# Altium project IOT Arduino Board 4 Layers.PrjPcb (part 1 of 2)
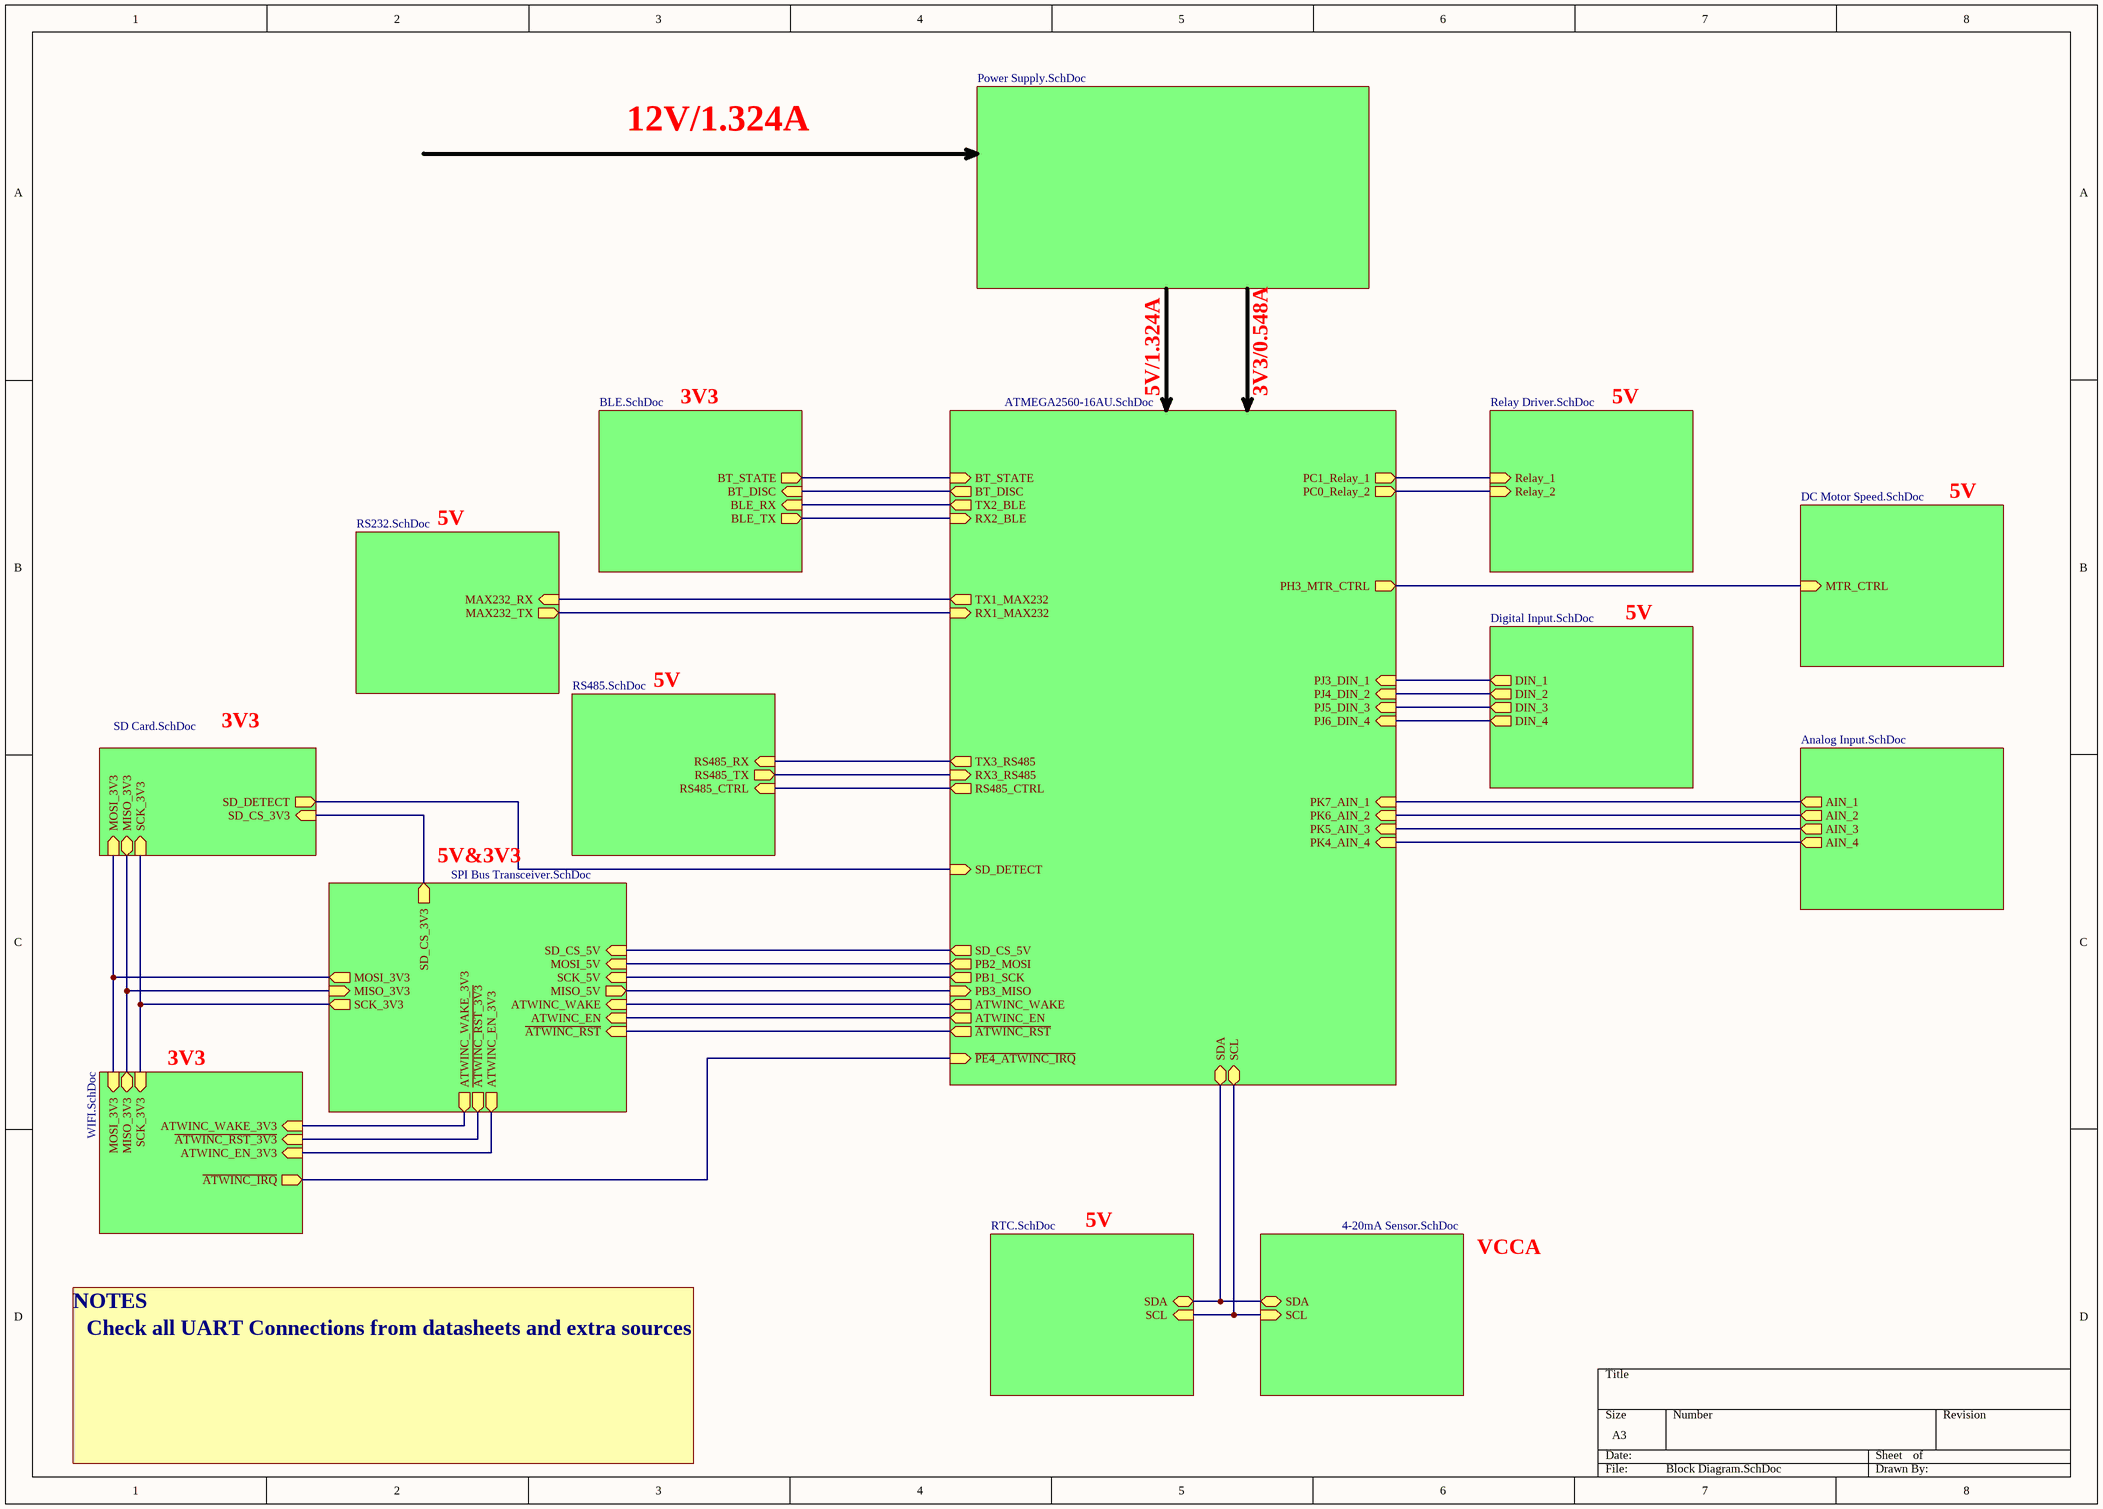
[diagram p0: Block Diagram.SchDoc]
15 sheets, 159 parts. Net scope: hierarchical (ports join the sheet entries above them; power ports are global).
Board file: PCB1.PcbDoc
Sheets:
  Block Diagram.SchDoc
    ATMEGA2560-16AU = ATMEGA2560-16AU.SchDoc
    Power Supply = Power Supply.SchDoc
    Relay Driver = Relay Driver.SchDoc
    DC Motor Speed = DC Motor Speed.SchDoc
    Digital Input = Digital Input.SchDoc
    Analog Input = Analog Input.SchDoc
    4-20mA Sensor = 4-20mA Sensor.SchDoc
    RTC = RTC.SchDoc
    BLE = BLE.SchDoc
    WIFI = WIFI.SchDoc
    SD Card = SD Card.SchDoc
    RS232 = RS232.SchDoc
    RS485 = RS485.SchDoc
    SPI Bus Transceiver = SPI Bus Transceiver.SchDoc

## Sheet Block Diagram.SchDoc
size A3; SheetNumber: 1; SheetTotal: 15

### Sub-sheets
4-20mA Sensor = 4-20mA Sensor.SchDoc: SCL (in), SDA (bidir)
Analog Input = Analog Input.SchDoc: AIN_1 (out), AIN_2 (out), AIN_3 (out), AIN_4 (out)
ATMEGA2560-16AU = ATMEGA2560-16AU.SchDoc: PC1_Relay_1 (out), PC0_Relay_2 (out), PH3_MTR_CTRL (out), PJ3_DIN_1 (in), PJ4_DIN_2 (in), PJ5_DIN_3 (in), PJ6_DIN_4 (in), PK7_AIN_1 (in), PK6_AIN_2 (in), PK5_AIN_3 (in), PK4_AIN_4 (in), SCL (bidir), SDA (bidir), RX2_BLE (in), TX2_BLE (out), BT_STATE (in), BT_DISC (out), SD_CS_5V (out), PB2_MOSI (out), PB1_SCK (out), SD_DETECT (in), PB3_MISO (in), RS485_CTRL (out), ATWINC_WAKE (out), ATWINC_EN (out), TX1_MAX232 (out), RX1_MAX232 (in), RX3_RS485 (in), TX3_RS485 (out), ~{ATWINC_RST} (out), ~{PE4_ATWINC_IRQ} (in)
BLE = BLE.SchDoc: BT_STATE (out), BT_DISC (in), BLE_RX (in), BLE_TX (out)
DC Motor Speed = DC Motor Speed.SchDoc: MTR_CTRL (in)
Digital Input = Digital Input.SchDoc: DIN_1 (out), DIN_2 (out), DIN_3 (out), DIN_4 (out)
Power Supply = Power Supply.SchDoc: no entries
Relay Driver = Relay Driver.SchDoc: Relay_1 (in), Relay_2 (in)
RS232 = RS232.SchDoc: MAX232_RX (in), MAX232_TX (out)
RS485 = RS485.SchDoc: RS485_RX (in), RS485_TX (out), RS485_CTRL (in)
RTC = RTC.SchDoc: SCL (in), SDA (bidir)
SD Card = SD Card.SchDoc: SD_DETECT (out), MISO_3V3 (bidir), SCK_3V3 (in), MOSI_3V3 (in), SD_CS_3V3 (in)
SPI Bus Transceiver = SPI Bus Transceiver.SchDoc: SD_CS_5V (in), MOSI_5V (in), SCK_5V (in), SCK_3V3 (out), MOSI_3V3 (out), ATWINC_EN_3V3 (out), ~{ATWINC_RST_3V3} (out), ATWINC_WAKE (in), ATWINC_EN (in), MISO_5V (out), MISO_3V3 (in), SD_CS_3V3 (out), ATWINC_WAKE_3V3 (out), ~{ATWINC_RST} (in)
WIFI = WIFI.SchDoc: MOSI_3V3 (in), MISO_3V3 (bidir), SCK_3V3 (in), ~{ATWINC_IRQ} (out), ~{ATWINC_RST_3V3} (in), ATWINC_EN_3V3 (in), ATWINC_WAKE_3V3 (in)

### Nets
~{ATWINC_RST}: sheet ATMEGA2560-16AU/~{ATWINC_RST}, sheet SPI Bus Transceiver/~{ATWINC_RST}
ATWINC_EN: sheet ATMEGA2560-16AU/ATWINC_EN, sheet SPI Bus Transceiver/ATWINC_EN
MISO: sheet ATMEGA2560-16AU/PB3_MISO, sheet SPI Bus Transceiver/MISO_5V
MOSI: sheet ATMEGA2560-16AU/PB2_MOSI, sheet SPI Bus Transceiver/MOSI_5V
SCK: sheet ATMEGA2560-16AU/PB1_SCK, sheet SPI Bus Transceiver/SCK_5V
SD_CS_5V: sheet ATMEGA2560-16AU/SD_CS_5V, sheet SPI Bus Transceiver/SD_CS_5V
NetD12_K: sheet ATMEGA2560-16AU/PK4_AIN_4, sheet Analog Input/AIN_4
NetD13_K: sheet ATMEGA2560-16AU/PK5_AIN_3, sheet Analog Input/AIN_3
NetD14_K: sheet ATMEGA2560-16AU/PK6_AIN_2, sheet Analog Input/AIN_2
NetD15_K: sheet ATMEGA2560-16AU/PK7_AIN_1, sheet Analog Input/AIN_1
NetJ14_1: sheet ATMEGA2560-16AU/BT_STATE, sheet BLE/BT_STATE
NetJ14_4: sheet ATMEGA2560-16AU/RX2_BLE, sheet BLE/BLE_TX
NetJ14_6: sheet ATMEGA2560-16AU/BT_DISC, sheet BLE/BT_DISC
NetJ15_2: sheet SD Card/SD_CS_3V3, sheet SPI Bus Transceiver/SD_CS_3V3
NetJ15_3: sheet WIFI/MOSI_3V3, sheet SD Card/MOSI_3V3, sheet SPI Bus Transceiver/MOSI_3V3
NetJ15_5: sheet WIFI/SCK_3V3, sheet SD Card/SCK_3V3, sheet SPI Bus Transceiver/SCK_3V3
NetJ15_7: sheet WIFI/MISO_3V3, sheet SD Card/MISO_3V3, sheet SPI Bus Transceiver/MISO_3V3
NetJ15_CD: sheet ATMEGA2560-16AU/SD_DETECT, sheet SD Card/SD_DETECT
NetR7_1: sheet ATMEGA2560-16AU/SCL, sheet 4-20mA Sensor/SCL, sheet RTC/SCL
NetR8_1: sheet ATMEGA2560-16AU/SDA, sheet 4-20mA Sensor/SDA, sheet RTC/SDA
NetR9_2: sheet ATMEGA2560-16AU/PC1_Relay_1, sheet Relay Driver/Relay_1
NetR11_2: sheet ATMEGA2560-16AU/PC0_Relay_2, sheet Relay Driver/Relay_2
NetR13_2: sheet ATMEGA2560-16AU/PH3_MTR_CTRL, sheet DC Motor Speed/MTR_CTRL
NetR16_5: sheet ATMEGA2560-16AU/PJ6_DIN_4, sheet Digital Input/DIN_4
NetR16_6: sheet ATMEGA2560-16AU/PJ5_DIN_3, sheet Digital Input/DIN_3
NetR16_7: sheet ATMEGA2560-16AU/PJ4_DIN_2, sheet Digital Input/DIN_2
NetR16_8: sheet ATMEGA2560-16AU/PJ3_DIN_1, sheet Digital Input/DIN_1
NetR42_1: sheet WIFI/ATWINC_EN_3V3, sheet SPI Bus Transceiver/ATWINC_EN_3V3
NetR43_2: sheet ATMEGA2560-16AU/~{PE4_ATWINC_IRQ}, sheet WIFI/~{ATWINC_IRQ}
NetU3_9: sheet ATMEGA2560-16AU/ATWINC_WAKE, sheet SPI Bus Transceiver/ATWINC_WAKE
NetU3_13: sheet ATMEGA2560-16AU/TX2_BLE, sheet BLE/BLE_RX
NetU3_45: sheet ATMEGA2560-16AU/RX1_MAX232, sheet RS232/MAX232_TX
NetU3_46: sheet ATMEGA2560-16AU/TX1_MAX232, sheet RS232/MAX232_RX
NetU3_63: sheet ATMEGA2560-16AU/RX3_RS485, sheet RS485/RS485_TX
NetU3_64: sheet ATMEGA2560-16AU/TX3_RS485, sheet RS485/RS485_RX
NetU3_65: sheet ATMEGA2560-16AU/RS485_CTRL, sheet RS485/RS485_CTRL
NetU11_4: sheet WIFI/~{ATWINC_RST_3V3}, sheet SPI Bus Transceiver/~{ATWINC_RST_3V3}
NetU11_11: sheet WIFI/ATWINC_WAKE_3V3, sheet SPI Bus Transceiver/ATWINC_WAKE_3V3

### Notes on the sheet
- 12V/1.324A
- 3V3
- 5V/1.324A
- 3V3/0.548A
- 5V
- 5V&3V3
- VCCA
- NOTES
- Check all UART Connections from datasheets and extra sources

## Sheet ATMEGA2560-16AU.SchDoc
size A; SheetNumber: 3; SheetTotal: 15
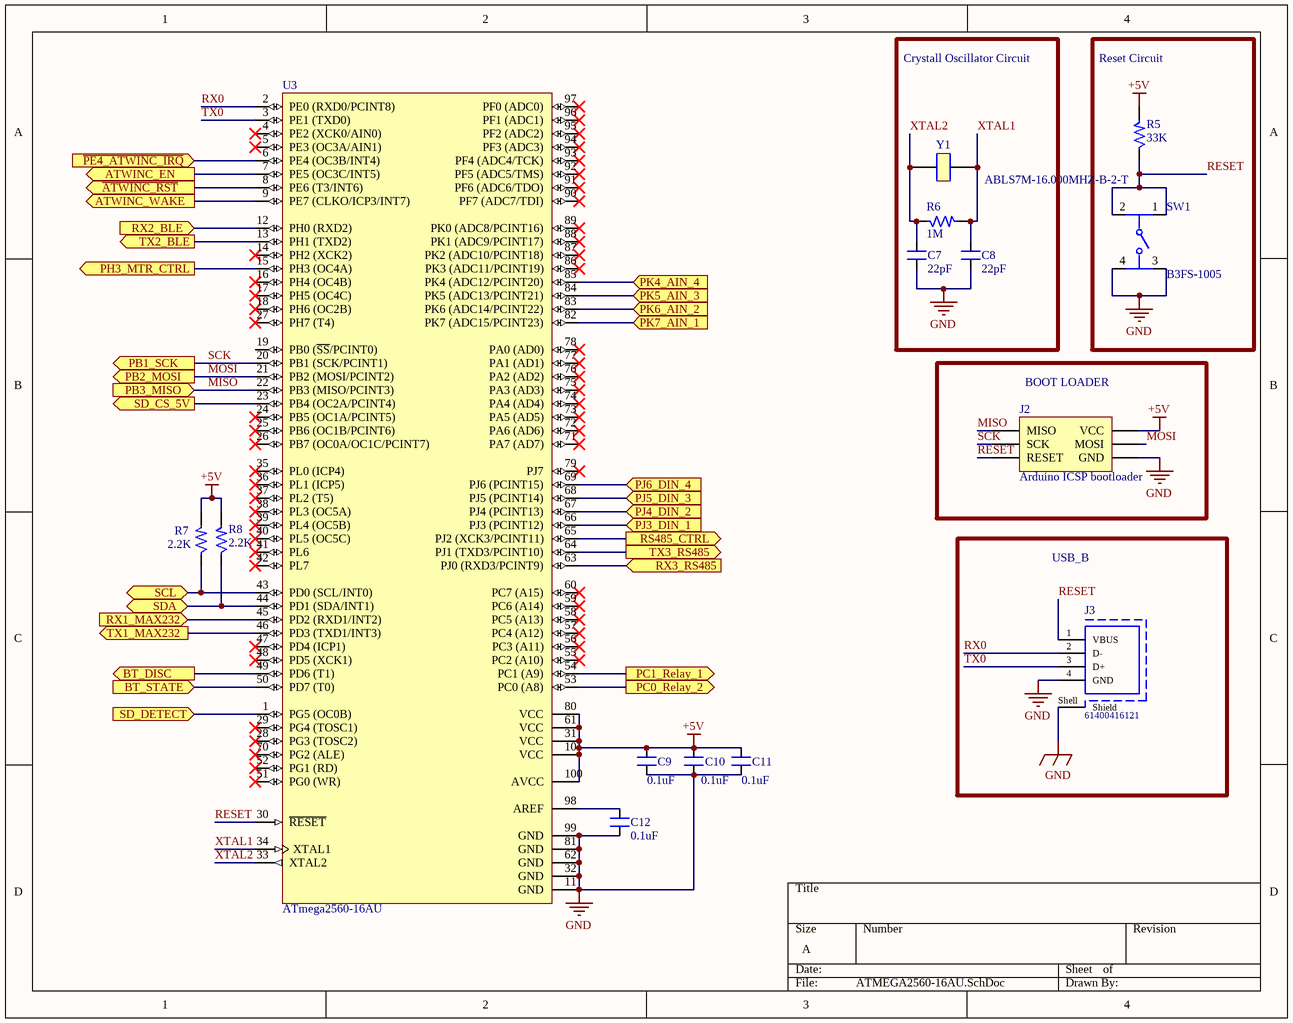
[diagram p1: ATMEGA2560-16AU.SchDoc]

### Parts
C7  22pF  [CAP_0805]
C8  22pF  [CAP_0805]
C9  0.1uF  [CAP_0805]
C10  0.1uF  [CAP_0805]
C11  0.1uF  [CAP_0805]
C12  0.1uF  [CAP_0805]
J2  Arduino ICSP bootloader  [HDR2X3]
J3  61400416121  [61400416121]
R5  33K  [RES_0805]
R6  1M  [RES_0805]
R7  2.2K  [RES_0805]
R8  2.2K  [RES_0805]
SW1  B3FS-1005  [FP-B3FS-1005-MFG]
U3  ATmega2560-16AU  [100A_L]
Y1  ABLS7M-16.000MHZ-B-2-T  [XTAL_314_240X47_SMD]

### Blocks framed on the sheet
Crystall Oscillator Circuit: C7 C8 R6 Y1
Reset Circuit: R5 SW1
BOOT LOADER: J2
USB_B: J3

### Ports
ATWINC_EN (out, see Block Diagram[4C], SPI Bus Transceiver[1C]), ATWINC_WAKE (out, see Block Diagram[4C], SPI Bus Transceiver[1C]), BT_DISC (out, see Block Diagram[4B], BLE[3B]), BT_STATE (in, see Block Diagram[4B], BLE[3B]), PB1_SCK (out, see Block Diagram[4C]), PB2_MOSI (out, see Block Diagram[4C]), PB3_MISO (in, see Block Diagram[4C]), PC0_Relay_2 (out, see Block Diagram[6B]), PC1_Relay_1 (out, see Block Diagram[6B]), PH3_MTR_CTRL (out, see Block Diagram[6B]), PJ3_DIN_1 (in, see Block Diagram[6B]), PJ4_DIN_2 (in, see Block Diagram[6B]), PJ5_DIN_3 (in, see Block Diagram[6B]), PJ6_DIN_4 (in, see Block Diagram[6B]), PK4_AIN_4 (in, see Block Diagram[6C]), PK5_AIN_3 (in, see Block Diagram[6C]), PK6_AIN_2 (in, see Block Diagram[6C]), PK7_AIN_1 (in, see Block Diagram[6C]), RS485_CTRL (out, see Block Diagram[4C], RS485[1B]), RX1_MAX232 (in, see Block Diagram[4B]), RX2_BLE (in, see Block Diagram[4B]), RX3_RS485 (in, see Block Diagram[4C]), SCL (bidir, see Block Diagram[5C], 4-20mA Sensor[4B], RTC[1B]), SD_CS_5V (out, see Block Diagram[4C], SPI Bus Transceiver[2C]), SD_DETECT (in, see Block Diagram[4C], SD Card[3B]), SDA (bidir, see Block Diagram[5C], 4-20mA Sensor[4B], RTC[1B]), TX1_MAX232 (out, see Block Diagram[4B]), TX2_BLE (out, see Block Diagram[4B]), TX3_RS485 (out, see Block Diagram[4C]), ~{ATWINC_RST} (out, see Block Diagram[4C], SPI Bus Transceiver[1C]), ~{PE4_ATWINC_IRQ} (in, see Block Diagram[4C])

### Nets
+5V: C9.2 C10.2 C11.2 J2.2(VCC) R5.2 R7.2 R8.2 U3.10(VCC) U3.31(VCC) U3.61(VCC) U3.80(VCC) U3.100(AVCC)
GND: C7.1 C8.1 C9.1 C10.1 C11.1 C12.1 J2.6(GND) J3.4(GND) J3.Shell(Shield) SW1.3 SW1.4 U3.11(GND) U3.32(GND) U3.62(GND) U3.81(GND) U3.99(GND)
~{ATWINC_RST}: U3.8(PE6_(T3/INT6)) ; port ~{ATWINC_RST}
ATWINC_EN: U3.7(PE5_(OC3C/INT5)) ; port ATWINC_EN
MISO: J2.1(MISO) U3.22(PB3_(MISO/PCINT3)) ; port PB3_MISO
MOSI: J2.4(MOSI) U3.21(PB2_(MOSI/PCINT2)) ; port PB2_MOSI
RESET: J2.5(RESET) J3.1(VBUS) R5.1 SW1.1 SW1.2 U3.30(~{RESET})
RX0: J3.2(D-) U3.2(PE0_(RXD0/PCINT8))
SCK: J2.3(SCK) U3.20(PB1_(SCK/PCINT1)) ; port PB1_SCK
SD_CS_5V: U3.23(PB4_(OC2A/PCINT4)) ; port SD_CS_5V
TX0: J3.3(D+) U3.3(PE1_(TXD0))
XTAL1: C8.2 R6.2 U3.34(XTAL1) Y1.2
XTAL2: C7.2 R6.1 U3.33(XTAL2) Y1.1
NetC12_2: C12.2 U3.98(AREF)
NetD12_K: U3.85(PK4_(ADC12/PCINT20)) ; port PK4_AIN_4
NetD13_K: U3.84(PK5_(ADC13/PCINT21)) ; port PK5_AIN_3
NetD14_K: U3.83(PK6_(ADC14/PCINT22)) ; port PK6_AIN_2
NetD15_K: U3.82(PK7_(ADC15/PCINT23)) ; port PK7_AIN_1
NetJ14_1: U3.50(PD7_(T0)) ; port BT_STATE
NetJ14_4: U3.12(PH0_(RXD2)) ; port RX2_BLE
NetJ14_6: U3.49(PD6_(T1)) ; port BT_DISC
NetJ15_CD: U3.1(PG5_(OC0B)) ; port SD_DETECT
NetR7_1: R7.1 U3.43(PD0_(SCL/INT0)) ; port SCL
NetR8_1: R8.1 U3.44(PD1_(SDA/INT1)) ; port SDA
NetR9_2: U3.54(PC1_(A9)) ; port PC1_Relay_1
NetR11_2: U3.53(PC0_(A8)) ; port PC0_Relay_2
NetR13_2: U3.15(PH3_(OC4A)) ; port PH3_MTR_CTRL
NetR16_5: U3.69(PJ6_(PCINT15)) ; port PJ6_DIN_4
NetR16_6: U3.68(PJ5_(PCINT14)) ; port PJ5_DIN_3
NetR16_7: U3.67(PJ4_(PCINT13)) ; port PJ4_DIN_2
NetR16_8: U3.66(PJ3_(PCINT12)) ; port PJ3_DIN_1
NetR43_2: U3.6(PE4_(OC3B/INT4)) ; port ~{PE4_ATWINC_IRQ}
NetU3_9: U3.9(PE7_(CLKO/ICP3/INT7)) ; port ATWINC_WAKE
NetU3_13: U3.13(PH1_(TXD2)) ; port TX2_BLE
NetU3_45: U3.45(PD2_(RXD1/INT2)) ; port RX1_MAX232
NetU3_46: U3.46(PD3_(TXD1/INT3)) ; port TX1_MAX232
NetU3_63: U3.63(PJ0_(RXD3/PCINT9)) ; port RX3_RS485
NetU3_64: U3.64(PJ1_(TXD3/PCINT10)) ; port TX3_RS485
NetU3_65: U3.65(PJ2_(XCK3/PCINT11)) ; port RS485_CTRL

Not connected (* = marked no-connect by the designer): U3 4(PE2_(XCK0/AIN0))* 5(PE3_(OC3A/AIN1))* 14(PH2_(XCK2))* 16(PH4_(OC4B))* 17(PH5_(OC4C))* 18(PH6_(OC2B))* 19(PB0_(~{SS}/PCINT0)) 24(PB5_(OC1A/PCINT5))* 25(PB6_(OC1B/PCINT6))* 26(PB7_(OC0A/OC1C/PCINT7))* 27(PH7_(T4))* 28(PG3_(TOSC2))* 29(PG4_(TOSC1))* 35(PL0_(ICP4))* 36(PL1_(ICP5))* 37(PL2_(T5))* 38(PL3_(OC5A))* 39(PL4_(OC5B))* 40(PL5_(OC5C))* 41(PL6)* 42(PL7)* 47(PD4_(ICP1))* 48(PD5_(XCK1))* 51(PG0_(WR))* 52(PG1_(RD))* 55(PC2_(A10))* 56(PC3_(A11))* 57(PC4_(A12))* 58(PC5_(A13))* 59(PC6_(A14))* 60(PC7_(A15))* 70(PG2_(ALE))* 71(PA7_(AD7))* 72(PA6_(AD6))* 73(PA5_(AD5))* 74(PA4_(AD4))* 75(PA3_(AD3))* 76(PA2_(AD2))* 77(PA1_(AD1))* 78(PA0_(AD0))* 79(PJ7)* 86(PK3_(ADC11/PCINT19))* 87(PK2_(ADC10/PCINT18))* 88(PK1_(ADC9/PCINT17))* 89(PK0_(ADC8/PCINT16))* 90(PF7_(ADC7/TDI))* 91(PF6_(ADC6/TDO))* 92(PF5_(ADC5/TMS))* 93(PF4_(ADC4/TCK))* 94(PF3_(ADC3))* 95(PF2_(ADC2))* 96(PF1_(ADC1))* 97(PF0_(ADC0))*

### Library data of the parts
C7 C8 = CAP_22PF-50V-5%-0805: 22pF ±5% 50V Ceramic Capacitor C0G, NP0 0805 (2012 Metric); Manufacturer: Yageo; Manufacturer Part Number: CC0805JRNPO9BN220; Alternate Part Number-1: 0805CG220J500NT; Case/Package: 0805; Supplier-1: SIRICOM; Supplier Part Number-1: 0805N220J500CT
C9-C12 = CAP_0.1uF-50V-5%-0805: 0.1µF ±5% 50V Ceramic Capacitor X7R 0805 (2012 Metric); Manufacturer: AVX Corporation; Manufacturer Part Number: 08055C104JAT4A; Alternate Part Number-1: 0805B104M500; Case/Package: 0805; Supplier-1: SIRICOM; Supplier Part Number-1: 0805B104J500CT
J2 = ICSP: Header, 3-Pin, Dual row; LatestRevisionDate: 17-Jul-2002; LatestRevisionNote: Re-released for DXP Platform.; Publisher: Altium Limited
J3 = CON_USB-2.0-B-TH: USB 2.0 Type B Receptacle WR-COM, Horizontal, THT, with Pads and Pegs; Manufacturer: Wurth Elektronik; Contact Resistance: 20mOhm; Rated Current: 1.5A; Working Voltage: 30VAC; Package Reference: 61400416121; Part Number: 61400416121; Packaging: Tray; Mounting Technology: THT; Gender: Receptacle; Datasheet URL: https://katalog.we-online.de/em/datasheet/61400416121.pdf; Publisher: WurthElektronik; Orientation: Horizontal; Connector Type: USB2.0TypeB; Operating Temperature: -40to105degC; Manufacturer URL: http://www.we-online.de
R5 = RES_33K-0.125W-1%-0805: Thick Film Resistors - SMD 33KOhms 1/8W 150V33 kOhms ±1% 0.125W, 1/8W Chip Resistor 0805 (2012 Metric) Thick Film; Manufacturer: Vishay BCcomponents; Manufacturer Part Number: CRG0805F33K; Alternate Part Number-1: NA; Case/Package: 0805; Supplier-1: SIRICOM; Supplier Part Number-1: WR08X3302FTL
R6 = RES_1M-0.125W-1%-0805: 1 MOhms ±1% 0.125W, 1/8W Chip Resistor 0805 (2012 Metric) Automotive AEC-Q200 Thick Film; Manufacturer: Walsin; Manufacturer Part Number: WR08X1004FTL; Alternate Part Number-1: 0805W8F1004T5E; Case/Package: 0805; Supplier-1: SIRICOM; Supplier Part Number-1: WR08X1004FTL
R7 R8 = RES_2.2K-0.125W-1%-0805: 2.2 kOhms ±1% 0.125W, 1/8W Chip Resistor 0805 (2012 Metric) Thick Film; Manufacturer: Stackpole Electronics; Manufacturer Part Number: CRG0805F2K2; Alternate Part Number-1: CR0805F82201G; Case/Package: 0805; Supplier-1: SIRICOM; Supplier Part Number-1: WR08X2201FTL
SW1 = SWITCH TACTILE SPST: SWITCH TACTILE SPST-NO 0.05A 24V; Operating Force: 2.55N; Ratings: IP00; Illumination Type: Non-Illuminated; Switch Travel: 0.25mm; Electrical Life: 100000Cycles; Current Rating: 50mA; Mechanical Life: 300000Cycles; Switch Function: Off-Mom; Actuator Type: Standard; Throw Configuration: SPST; Number of Poles: 1; Actuator Length: 0.5mm; RoHS Compliant: Yes; Packaging: Bulk; Termination: Gull Wing; Max Operating Temperature: 70°C; Weight: 0.2g; Min Operating Temperature: -25°C; Contact Material: Silver; Length: 6mm; Height: 3.1mm; Mount: Surface Mount; Contact Current Rating: 50mA; Lead Free: Lead Free; Max Voltage Rating (DC): 24V; Orientation: Straight; Package Quantity: 100; Voltage Rating (DC): 24V; Series: B3FS; Width: 6mm
U3 = ATmega2560-16AU: 8-bit AVR Microcontroller, 4.5-5.5V, 16MHz, 256KB Flash, 4KB EEPROM, 8KB SRAM, 86 GPIO pins, 100-pin TQFP, Industrial Grade (-40°C to 85°C), Pb-Free; PackageDescription: 100-Pin Thin Profile Plastic Quad Flat Pack (TQFP), 14 x 14 x 1.0 mm Body, 0.5 mm Pitch; ComponentLink1Description: Manufacturer URL; ComponentLink3URL: http://www.atmel.com/dyn/resources/prod_documents/2549S.pdf; RevisionNote: DatasheetVersion & PackageVersion updated. URLs added.; DatasheetVersion: revN, May-2011; ComponentLink2Description: ATmega640/1280/1281/2560/2561 Datasheet; PackageReference: 100A; PackageVersion: revD, Oct-2010; Code_JEDEC: MS-026-AED; ComponentLink1URL: http://www.atmel.com/; ComponentLink2URL: http://www.atmel.com/dyn/resources/prod_documents/doc2549.pdf; ComponentLink3Description: ATmega640/1280/1281/2560/2561 Summary
Y1 = XTAL_16MHz-ABLS7M-16.000MHZ-B-2-T: 16MHz ±20ppm Crystal 18pF 60 Ohms 2-SMD, Flat Lead; Manufacturer: Abracon; Alternate Part Number-1: NA; Manufacturer Part Number: ABLS7M-16.000MHZ-B-2-T; Case/Package: SMD; Supplier-1: ARROW; Supplier Part Number-1: ABLS7M-16.000MHZ-B-2-T

## Sheet Power Supply.SchDoc
size A; SheetNumber: 2; SheetTotal: 15
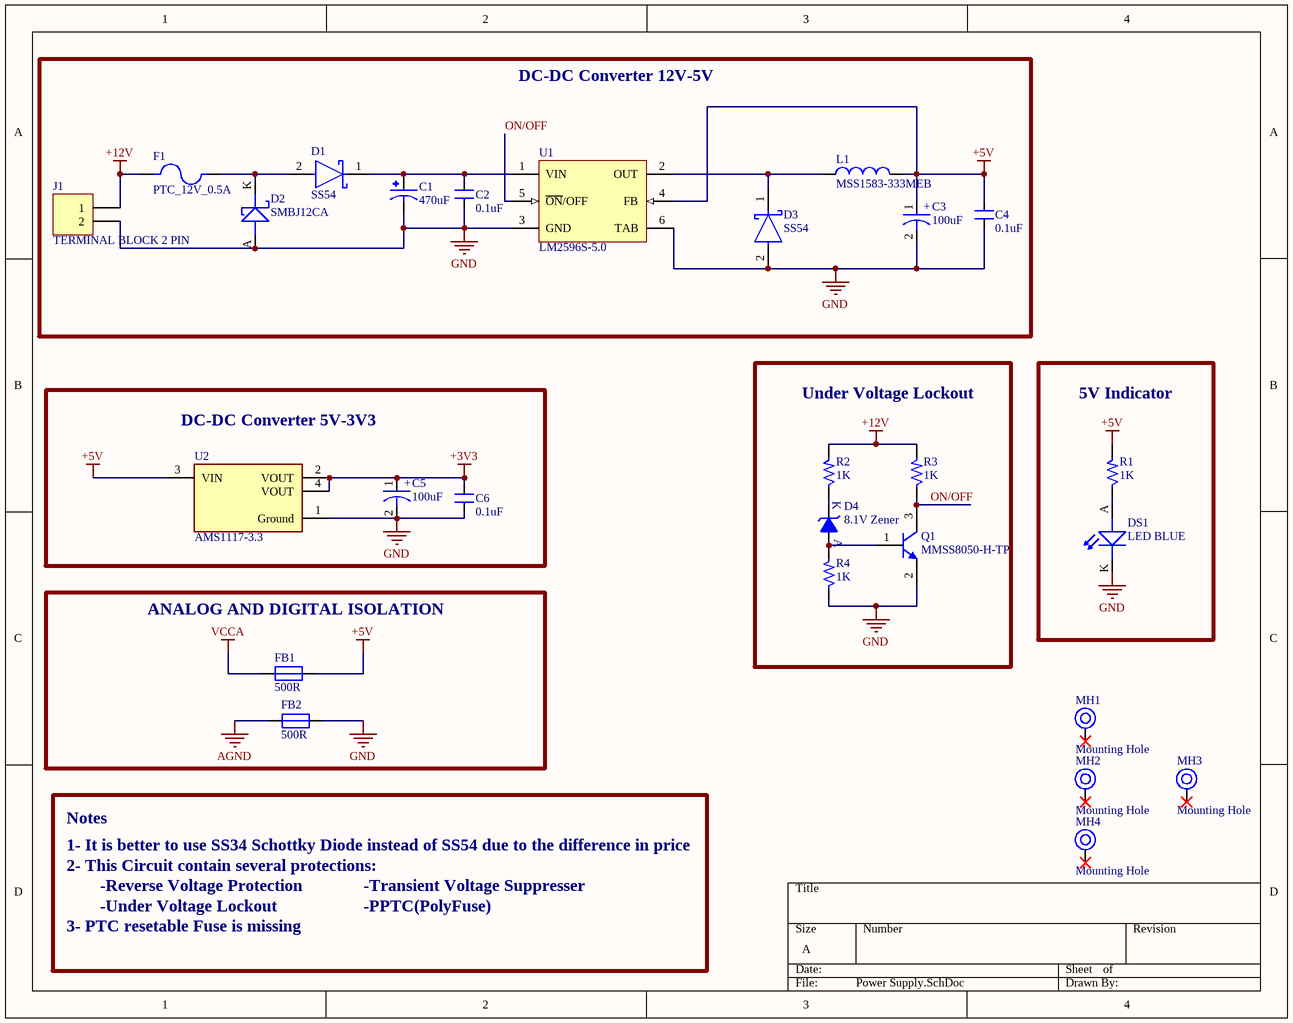
[diagram p2: Power Supply.SchDoc]

### Parts
C1  470uF  [CAPPRD500W50D630H1120]
C2  0.1uF  [CAP_0805]
C3  100uF  [ACAP_P305_D393_H393_RAD]
C4  0.1uF  [CAP_0805]
C5  100uF  [ACAP_P236_D305_H303_RAD]
C6  0.1uF  [CAP_0805]
D1  SS54  [FP-95400-MFG]
D2  SMBJ12CA  [DIO_SMB_DO-214AA]
D3  SS54  [FP-95400-MFG]
D4  8.1V Zener  [DIO_SOD80C]
DS1  LED BLUE  [LED_0805]
F1  PTC_12V_0.5A  [FUSER_MF-MSMF200]
FB1  500R  [IND_0805]
FB2  500R  [IND_0805]
J1  TERMINAL BLOCK 2 PIN  [CON2_P196_1729128_TH_ST]
L1  MSS1583-333MEB  [IND_456_640_236X117_SMD]
MH1  Mounting Hole  [MOUNTING]
MH2  Mounting Hole  [MOUNTING]
MH3  Mounting Hole  [MOUNTING]
MH4  Mounting Hole  [MOUNTING]
Q1  MMSS8050-H-TP  [SOT 23-3]
R1  1K  [RES_0805]
R2  1K  [RES_0805]
R3  1K  [RES_0805]
R4  1K  [RES_0805]
U1  LM2596S-5.0  [TO170P1524X483-6N]
U2  AMS1117-3.3  [FP-AMS1117-IPC_A]

### Blocks framed on the sheet
DC-DC Converter 12V-5V: C1-C4 D1-D3 F1 J1 L1 U1
DC-DC Converter 5V-3V3: C5 C6 U2
Under Voltage Lockout: D4 Q1 R2-R4
5V Indicator: DS1 R1
ANALOG AND DIGITAL ISOLATION: FB1 FB2

### Nets
+3V3: C5.1 C6.2 U2.2(VOUT) U2.4(VOUT)
+5V: C3.1 C4.2 FB1.2 L1.2 R1.2 U1.4(FB) U2.3(VIN)
+12V: F1.1 J1.1 R2.2 R3.2
AGND: FB2.1
GND: C1.N C2.1 C3.2 C4.1 C5.2 C6.1 D2.A D3.2(A) DS1.K(CATHODE) FB2.2 J1.2 Q1.2(E) R4.1 U1.3(GND) U1.6(TAB) U2.1(Ground)
VCCA: FB1.1
ON/OFF: Q1.3(C) R3.1 U1.5(~{ON}/OFF)
NetC1_P: C1.P C2.2 D1.1(C) U1.1(VIN)
NetD1_2: D1.2(A) D2.K F1.2
NetD3_1: D3.1(C) L1.1 U1.2(OUT)
NetD4_A: D4.A Q1.1(B) R4.2
NetD4_K: D4.K R2.1
NetDS1_A: DS1.A(ANODE) R1.1

Not connected (* = marked no-connect by the designer): MH1 1*; MH2 1*; MH3 1*; MH4 1*

### Notes on the sheet
- Notes
- 1- It is better to use SS34 Schottky Diode instead of SS54 due to the difference in price
- 2- This Circuit contain several protections:
- -Reverse Voltage Protection
- -Under Voltage Lockout
- -Transient Voltage Suppresser
- -PPTC(PolyFuse)
- 3- PTC resetable Fuse is missing
- (in symbol CAP-P_100uF-25V-20%-RAD) +
- (in symbol CAP-P_100uF-50V-20%-RAD) +

### Library data of the parts
C1 = CAP_100uF_25V_TH: 100F 25V Aluminum Electrolytic Capacitors Radial, Can 1000 Hrs @ 105C; MF: Panasonic; MP: EEU-FC1E101SB; Purchase-URL: https://pricing.snapeda.com/search/part/EEU-FC1E101SB/?ref=eda; Value: *; SnapEDA_Link: https://www.snapeda.com/parts/EEU-FC1E101SB/Panasonic/view-part/?ref=snap; Price: None; Package: RADIAL-2 Panasonic; Check_prices: https://www.snapeda.com/parts/EEU-FC1E101SB/Panasonic/view-part/?ref=eda; Availability: In Stock; ClassName: PWR
C2 C4 C6 = CAP_0.1uF-50V-20%-0805: 0.1µF ±20% 50V Ceramic Capacitor X7R 0805 (2012 Metric); Manufacturer: Samsung Electro-Mechanics; Manufacturer Part Number: CL21B104MBCNNNC; Alternate Part Number-1: NA; Case/Package: 0805; Supplier-1: SIRICOM; Supplier Part Number-1: 0805B104K500CT; ClassName: PWR
C3 = CAP-P_100uF-50V-20%-RAD: 100µF 50V Aluminum Polymer Capacitor Radial, Can - SMD 28mOhm 4000 Hrs @ 125°C; Manufacturer: Nichicon; Manufacturer Part Number: GYA1H101MCQ1GS; Alternate Part Number-1: VEU101M1HTR-1010; Case/Package: Radial-SMD; Supplier-1: SP ROAD; Supplier Part Number-1: GYA1H101MCQ1GS; ClassName: PWR
C5 = CAP-P_100uF-25V-20%-RAD: 100µF 25V Aluminum Electrolytic Capacitors Radial, Can - SMD 1000 Hrs @ 105°C; Manufacturer: Nichicon; Manufacturer Part Number: UWT1E101MCL1GS; Alternate Part Number-1: NA; Case/Package: Radial-SMD; Supplier-1: SP ROAD; Supplier Part Number-1: UWT1E101MCL1GS; ClassName: PWR
D1 D3 = SS54-Schottky-40V-3A-DO214AC: DIODE SCHOTTKY 40V 5A DO214AC; Element Configuration: Single; Max Reverse Leakage Current: 200uA; Polarity: Standard; Peak Non-Repetitive Surge Current: 100A; Max Reverse Current: 0.1mA; Forward Voltage: 550mV; Max Forward Surge Current (Ifsm): 75A; Radiation Hardening: No; Current Rating: 5A; Contact Plating: Tin; Output Current: 5A; Height: 2.087mm; Mount: Surface Mount; Case/Package: SMA; Packaging: Tape and Reel; Width: 2.79mm; Average Rectified Current: 5A; Max Repetitive Reverse Voltage (Vrrm): 40V; Max Operating Temperature: 150°C; Length: 4.5mm; RoHS Compliant: Yes; Voltage Rating (DC): 40V; Min Operating Temperature: -65°C; Max Reverse Voltage (DC): 40V; Number of Pins: 2; Lead Free: Lead Free; Forward Current: 5A; Max Surge Current: 100A; Package Quantity: 1; ClassName: PWR
D2 = DIO-T_12V-19.9V-30A-DO214AA: 19.9V Clamp 30.2A Ipp Tvs Diode Surface Mount DO-214AA (SMBJ); Manufacturer: Texas Instruments; Alternate Part Number-1: SMBJ12CA-H; Manufacturer Part Number: SMBJ12CA; Case/Package: DO214AA; Supplier-1: SIRICOM; Supplier Part Number-1: SMBJ12CA; ClassName: PWR
D4 = DIO-Z_8.1V-500mW-SOD-80: Zener Diode 8.2V 500mW Surface Mount SOD-80 MiniMELF; Manufacturer: Microsemi; Manufacturer Part Number: TZMA8V2-GS08; Alternate Part Number-1: NA; Case/Package: SOD-80; Supplier-1: SIRICOM; Supplier Part Number-1: BZV55-C8V2; ClassName: PWR
DS1 = LED_BLUE-3V3-20mA-0805: Blue 470nm LED Indication - Discrete 3.3V 0805 (2012 Metric); Manufacturer: Vishay Lite-On; Manufacturer Part Number: LTST-C171TBKT; Alternate Part Number-1: NA; Case/Package: 0805; Supplier-1: SP ROAD; Supplier Part Number-1: LTST-C171TBKT; ClassName: PWR
F1 = PTC_8V_2A_SMD_1812: MF-MSMF200_Polymeric PTC Resettable Fuse 8V 2A Ih Surface Mount 1812 (4532 Metric), Concave; MF: Bourns; Value: *; SnapEDA_Link: https://www.snapeda.com/parts/MF-MSMF200/Bourns/view-part/4874733/?ref=snap; MP: MF-MSMF200; Check_prices: https://www.snapeda.com/parts/MF-MSMF200/Bourns/view-part/4874733/?ref=eda; Availability: Unavailable; Price: None; Package: None; ClassName: PWR
FB1 FB2 = FB_500R-100Mhz-500mA-0805: 500 Ohms @ 100MHz 1 Ferrite Bead 0805 (2012 Metric) 500mA 300mOhm; Manufacturer: Abracon; Manufacturer Part Number: ACML-0805-501-T; Alternate Part Number-1: NA; Case/Package: 0805; Supplier-1: SIRICOM; Supplier Part Number-1: ACMS201209A601 2A; ClassName: PWR
J1 = CON-TB_2X1-196-ST-TH: 2 Pins, 1 Row 5mm Pitch, straight Connector, male; Manufacturer: Phoenix Contact; Manufacturer Part Number: MKDSN1,5/2; Alternate Part Number-1: NA; Case/Package: TH-CON; Supplier-1: SP ROAD; Supplier Part Number-1: MKDSN1,5/2; ClassName: PWR
L1 = IND_33uH-8A-20%-SMD: Fixed Inductors MSS1583 SMT Power 0.038Ohms 33uH; Manufacturer: Coilcraft; Alternate Part Number-1: NA; Manufacturer Part Number: MSS1583-333MEB; Case/Package: SMD; Supplier-1: COILCRAFT SAMPLE; Supplier Part Number-1: MSS1583-333MEB; ClassName: PWR
MH1-MH4 = MH_3.5H_6D: Manufacturer Part Number: NA; Case/Package: TH; Manufacturer: NA; Supplier-1: NA; Supplier Part Number-1: NA; Alternate Part Number-1: NA
Q1 = TRNS-NPN_25V-1.5A-SOT23: Bipolar (BJT) Transistor NPN 25V 1.5A 100MHz 625mW Surface Mount SOT-23; Manufacturer: MCC; Alternate Part Number-1: NA; Manufacturer Part Number: MMSS8050-H-TP; Case/Package: SOT-23; Supplier-1: MOUSER; Supplier Part Number-1: MMSS8050-H-TP; ClassName: PWR
R1-R4 = RES_1K-0.125W-1%-0805: 1 kOhms ±1% 0.125W, 1/8W Chip Resistor 0805 (2012 Metric) Moisture Resistant Thick Film; Manufacturer: Walsin; Manufacturer Part Number: WR08X1001FTL; Case/Package: 0805; Supplier-1: SP ROAD; Supplier Part Number-1: RC0805JR-071KL; Alternate Part Number-1: WR08X1001FTL; ClassName: PWR
U1 = LM2596S-5.0/SMPS: SIMPLE SWITCHER® Power Converter 150 KHz 3A Step-Down Voltage Regulator, 5-pin TO-263, Pb-Free; Manufacturer: Texas Instruments; PowerWise: N; PackageTopMarking: NSUZXYTTE#*LM2596S*-5.0 P+; ComponentLink1URL: http://www.ti.com/general/docs/lit/getliterature.tsp?genericPartNumber=LM2596&fileType=pdf; PackageDescription: TO-263, Molded, .400 x .390 x .180in, 5 Lead, .067in Pitch, Surface Mount; RoHS: Y; PinCount: 5; Code_JEDEC: MO-169-AB; ComponentLink1Description: Datasheet URL; PackageReference: KTT0005B; CompType: Switcher; ClassName: PWR
U2 = AMS1117-3.3/LDO: LDO Voltage Regulators 1A, 3.3V; Manufacturer: Advanced Monolithic Systems; Dropout Voltage: 1.1V; Output Type: Fixed; Nominal Supply Current: 5mA; Max Power Dissipation: 1.2W; Max Supply Voltage: 15V; Number Of Outputs: 1; Standoff Height: 0.64mm; Max Junction Temp: +125°C; Height: 1.8mm; Package: AMS1117; Device Class L2: Power Management ICs; ComponentLink2Description: Datasheet; ComponentLink2URL: http://www.advanced-monolithic.com/pdf/ds1117.pdf; Category: IC; RoHS: TRUE; Automotive: No; Device Class L1: Integrated Circuits (ICs); Output Current: 1A; Device Class L3: Voltage Regulators - Linear; Temperature: -40°C to +125°C; Output Voltage: 3.3V; Manufacturer Part Number: AMS1117-3.3; Temperature Range Low: -40°C; Octopart: https://octopart.com/ams1117-3.3-advanced+monolithic+systems-25899300; Lead Free: Yes; Ipc Land Pattern Name: SOT229P700X180-4; Temperature Range High: +125°C; ClassName: PWR

## Sheet Relay Driver.SchDoc
size A; SheetNumber: 4; SheetTotal: 15
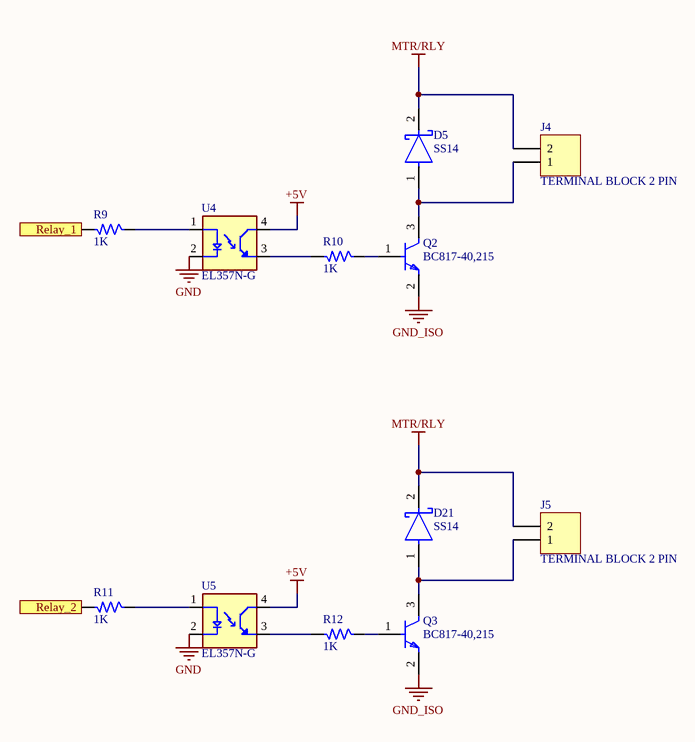
[diagram p3: Relay Driver.SchDoc]

### Parts
D5  SS14  [FP-403AE-MFG]
D21  SS14  [FP-403AE-MFG]
J4  TERMINAL BLOCK 2 PIN  [CON2_P196_1729128_TH_ST]
J5  TERMINAL BLOCK 2 PIN  [CON2_P196_1729128_TH_ST]
Q2  BC817-40,215  [FP-SOT23-IPC_A]
Q3  BC817-40,215  [FP-SOT23-IPC_A]
R9  1K  [RES_0805]
R10  1K  [RES_0805]
R11  1K  [RES_0805]
R12  1K  [RES_0805]
U4  EL357N-G  [OPTO_EL357N-G]
U5  EL357N-G  [OPTO_EL357N-G]

### Ports
Relay_1 (in, see Block Diagram[6B]), Relay_2 (in, see Block Diagram[6B])

### Nets
+5V: U4.4(CT) U5.4(CT)
GND: U4.2(C) U5.2(C)
GND_ISO: Q2.2(E) Q3.2(E)
MTR/RLY: D5.2(C) D21.2(C) J4.2 J5.2
NetD5_1: D5.1(A) J4.1 Q2.3(C)
NetD21_1: D21.1(A) J5.1 Q3.3(C)
NetQ2_1: Q2.1(B) R10.1
NetQ3_1: Q3.1(B) R12.1
NetR9_1: R9.1 U4.1(A)
NetR9_2: R9.2 ; port Relay_1
NetR10_2: R10.2 U4.3(ET)
NetR11_1: R11.1 U5.1(A)
NetR11_2: R11.2 ; port Relay_2
NetR12_2: R12.2 U5.3(ET)

### Library data of the parts
D5 D21 = SS14: DIODE SCHOTTKY 40V 1A SMA; Manufacturer: ON Semiconductor; Peak Reverse Current: 0.2mA; Max Junction Temp: +125°C; Standoff Height: 0.05mm; Max Surge Forward Current: 40A; Mouser Description: Schottky Diodes & Rectifiers SMA 40V 1.0A; RoHS: TRUE; Lead Free: Yes; Manufacturer Part Number: SS14; Device Class L3: Schottky Diodes; Category: Diode; Automotive: No; Digikey Description: DIODE SCHOTTKY 40V 1A SMA; ComponentLink2Description: Datasheet; Device Class L2: Diodes; Height: 2.5mm; Temperature Range High: +125°C; ComponentLink2URL: https://www.onsemi.com/pub/Collateral/SS19-D.PDF; Device Class L1: Discrete Semiconductors; Package: 403AE; Octopart: https://octopart.com/ss14-on+semiconductor-29205033; Max Repetitive Reverse Voltage: 40V; Temperature Range Low: -65°C; Forward Current: 1A; Temperature: -65°C to +125°C
J4 J5 = CON-TB_2X1-196-ST-TH: as J1 on sheet Power Supply; Case/Package: TH-CON; Supplier-1: SP ROAD; Supplier Part Number-1: MKDSN1,5/2
Q2 Q3 = CMP-14406-000007-1: TRANS NPN 45V 0.5A SOT23; Manufacturer: Nexperia; Collector Emitter Saturation Voltage: 700mV; Power Dissipation: 250mW; Collector Base Voltage: 50V; Unity Gain Freq: 100MHz; Hfe Max: 600; Rthja Max: 500K/W; Emitter Base Voltage: 5V; Max Collector Current: 500mA; Hfe Testvce: 1V; Automotive Grade: Grade 0; Hfe Min: 250; Max Junction Temp: +150°C; Number Of Npn: 1; Hfe Testic: 100mA; Octopart: https://octopart.com/bc817-40%2C215-nexperia-78739081; Lead Free: Yes; Ipc Land Pattern Name: SOT95P230X100-3; Manufacturer Part Number: BC817-40,215; RoHS: TRUE; Collector Emitter Breakdown Voltage: 45V; Digikey Description: TRANS NPN 45V 0.5A SOT23; ComponentLink2URL: https://assets.nexperia.com/documents/data-sheet/BC817_SER.pdf; Temperature Range High: +150°C; Mouser Description: BC817 Series 45 V 500 mA 250 mW SMT NPN General-Purpose Transistor - SOT-23-; Device Class L3: BJTs; Temperature: to +150°C; Height: 1.1mm; Automotive: Yes; Ambient Temperature Range Low: -65°C; Package: SOT23; Collector Emitter Voltage: 45V; Category: Trans; ComponentLink2Description: Datasheet; Device Class L2: Transistors; Ambient Temperature Range High: +150°C; Number Of Elements: 1; Device Class L1: Discrete Semiconductors; Footprint Url: https://assets.nexperia.com/documents/outline-drawing/SOT23.pdf
R9-R12 = RES_1K-0.125W-1%-0805: as R1 on sheet Power Supply; Case/Package: 0805; Supplier-1: SP ROAD; Supplier Part Number-1: RC0805JR-071KL; Alternate Part Number-1: WR08X1001FTL
U4 U5 = EL357N-G: PHOTOTRANSISTOR PHOTOCOUPLER; Package: None; Price: None; Availability: Unavailable; MP: EL357N-G; Value: *

## Sheet DC Motor Speed.SchDoc
size A; SheetNumber: 5; SheetTotal: 15
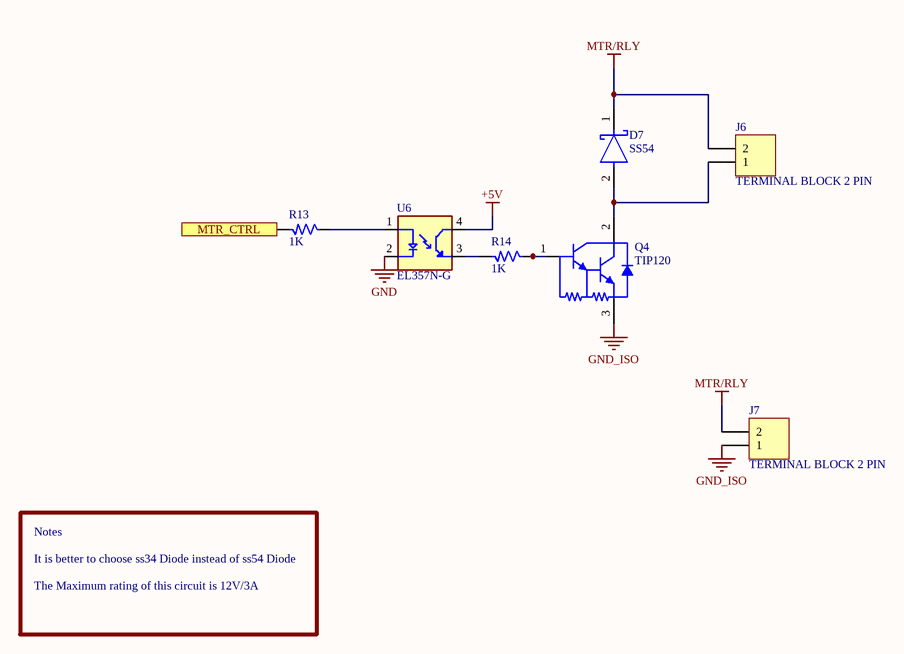
[diagram p4: DC Motor Speed.SchDoc]

### Parts
D7  SS54  [FP-95400-MFG]
J6  TERMINAL BLOCK 2 PIN  [CON2_P196_1729128_TH_ST]
J7  TERMINAL BLOCK 2 PIN  [CON2_P196_1729128_TH_ST]
Q4  TIP120  [ONSC-TO-220-3-221A-09]
R13  1K  [RES_0805]
R14  1K  [RES_0805]
U6  EL357N-G  [OPTO_EL357N-G]

### Ports
MTR_CTRL (in, see Block Diagram[7B])

### Nets
+5V: U6.4(CT)
GND: U6.2(C)
GND_ISO: J7.1 Q4.3(E)
MTR/RLY: D7.1(C) J6.2 J7.2
NetD7_2: D7.2(A) J6.1 Q4.2(C)
NetQ4_1: Q4.1(B) R14.1
NetR13_1: R13.1 U6.1(A)
NetR13_2: R13.2 ; port MTR_CTRL
NetR14_2: R14.2 U6.3(ET)

### Notes on the sheet
- Notes
- It is better to choose ss34 Diode instead of ss54 Diode
- The Maximum rating of this circuit is 12V/3A

### Library data of the parts
D7 = SS54-Schottky-40V-3A-DO214AC: as D1 on sheet Power Supply; Radiation Hardening: No; Current Rating: 5A; Contact Plating: Tin; Output Current: 5A; Height: 2.087mm; Mount: Surface Mount; Case/Package: SMA; Packaging: Tape and Reel; Width: 2.79mm; Average Rectified Current: 5A; Max Repetitive Reverse Voltage (Vrrm): 40V; Max Operating Temperature: 150°C; Length: 4.5mm; RoHS Compliant: Yes; Voltage Rating (DC): 40V; Min Operating Temperature: -65°C; Max Reverse Voltage (DC): 40V; Number of Pins: 2; Lead Free: Lead Free; Forward Current: 5A; Max Surge Current: 100A; Package Quantity: 1
J6 J7 = CON-TB_2X1-196-ST-TH: as J1 on sheet Power Supply; Case/Package: TH-CON; Supplier-1: SP ROAD; Supplier Part Number-1: MKDSN1,5/2
Q4 = TIP120: Plastic Medium-Power, Complementary Silicon Transistor, 3-Pin TO-220, Tube; Manufacturer: On Semiconductor; IC Continuous (A): 5; Polarity: NPN; ComponentLink2URL: http://www.onsemi.cn/pub_link/Collateral/TIP120-D.PDF; Packing: Tube; PartNumber: TIP120; ComponentLink3Description: Package Specification; PackageDescription: 3-Pin Flange Mount, Vertical Straight Lead, Body 9.97 x 4.445 mm, Pitch 2.54 mm; Mounting Technology: Through Hole; ComponentLink1URL: http://www.onsemi.com/; PackageVersion: Rev. AG, 09/2011; ComponentLink1Description: Manufacturer URL; PackageReference: TO-220-3-221A-09; ComponentLink2Description: Datasheet; RoHS: FALSE; DatasheetVersion: Rev. 8; ComponentLink3URL: http://www.onsemi.com/pub_link/Collateral/221A-09.PDF
R13 R14 = RES_1K-0.125W-1%-0805: as R1 on sheet Power Supply; Case/Package: 0805; Supplier-1: SP ROAD; Supplier Part Number-1: RC0805JR-071KL; Alternate Part Number-1: WR08X1001FTL
U6 = EL357N-G: PHOTOTRANSISTOR PHOTOCOUPLER; Package: None; Price: None; Availability: Unavailable; MP: EL357N-G; Value: *

## Sheet Digital Input.SchDoc
size A; SheetNumber: 7; SheetTotal: 15
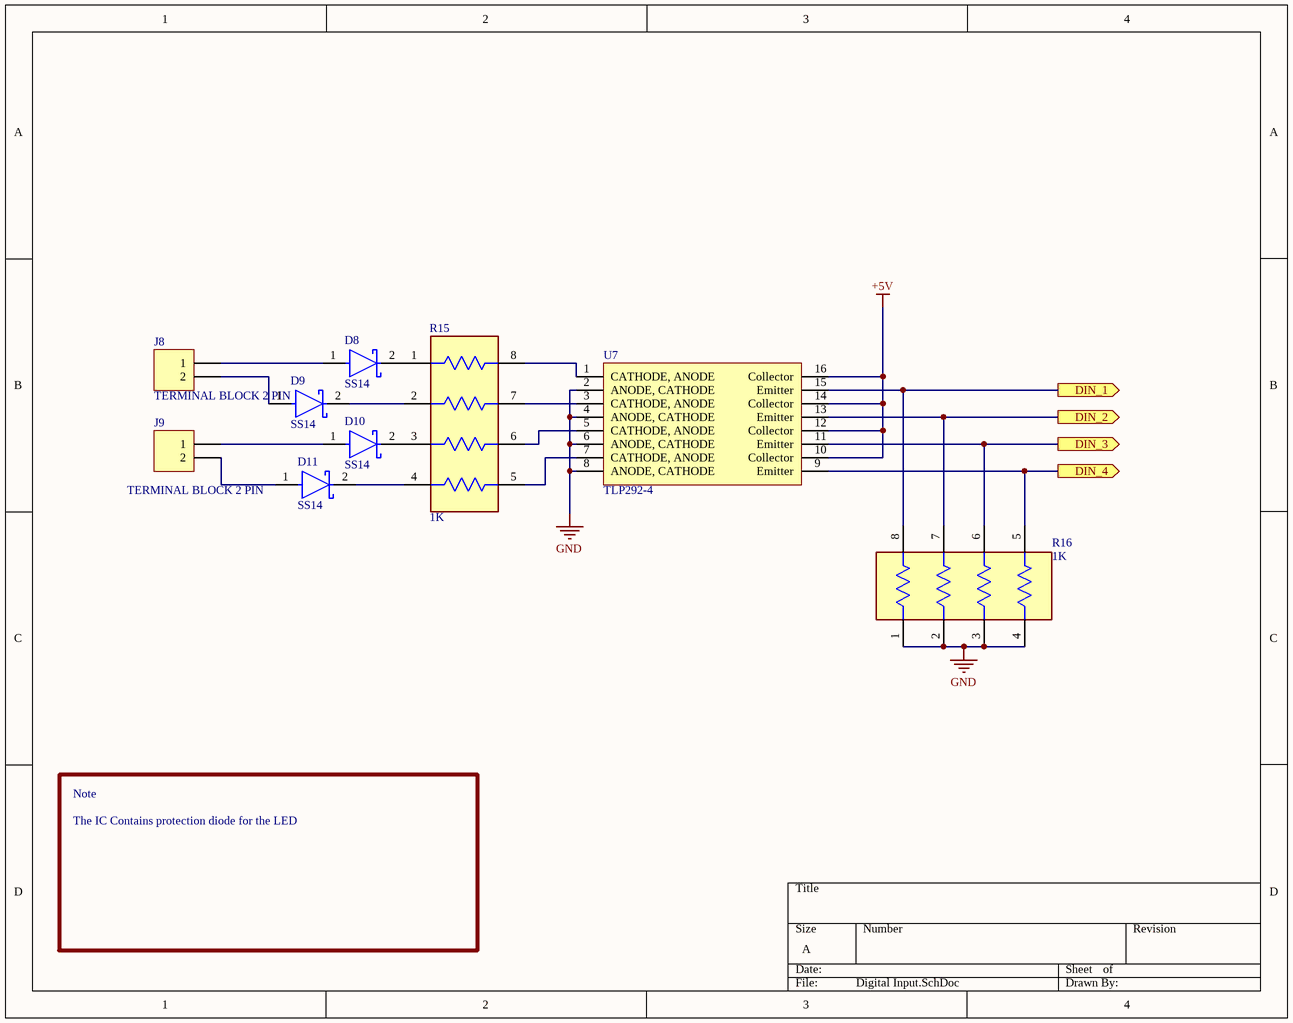
[diagram p5: Digital Input.SchDoc]

### Parts
D8  SS14  [FP-403AE-MFG]
D9  SS14  [FP-403AE-MFG]
D10  SS14  [FP-403AE-MFG]
D11  SS14  [FP-403AE-MFG]
J8  TERMINAL BLOCK 2 PIN  [CON2_P196_1729128_TH_ST]
J9  TERMINAL BLOCK 2 PIN  [CON2_P196_1729128_TH_ST]
R15  1K  [FP-YC164-MFG]
R16  1K  [FP-YC164-MFG]
U7  TLP292-4  [SOIC16_50_284_25X90_SMT]

### Ports
DIN_1 (out, see Block Diagram[6B]), DIN_2 (out, see Block Diagram[6B]), DIN_3 (out, see Block Diagram[6B]), DIN_4 (out, see Block Diagram[6B])

### Nets
+5V: U7.10(Collector) U7.12(Collector) U7.14(Collector) U7.16(Collector)
GND: R16.1 R16.2 R16.3 R16.4 U7.2(ANODE,_CATHODE) U7.4(ANODE,_CATHODE) U7.6(ANODE,_CATHODE) U7.8(ANODE,_CATHODE)
NetD8_1: D8.1(A) J8.1
NetD8_2: D8.2(C) R15.1
NetD9_1: D9.1(A) J8.2
NetD9_2: D9.2(C) R15.2
NetD10_1: D10.1(A) J9.1
NetD10_2: D10.2(C) R15.3
NetD11_1: D11.1(A) J9.2
NetD11_2: D11.2(C) R15.4
NetR15_5: R15.5 U7.7(CATHODE,_ANODE)
NetR15_6: R15.6 U7.5(CATHODE,_ANODE)
NetR15_7: R15.7 U7.3(CATHODE,_ANODE)
NetR15_8: R15.8 U7.1(CATHODE,_ANODE)
NetR16_5: R16.5 U7.9(Emitter) ; port DIN_4
NetR16_6: R16.6 U7.11(Emitter) ; port DIN_3
NetR16_7: R16.7 U7.13(Emitter) ; port DIN_2
NetR16_8: R16.8 U7.15(Emitter) ; port DIN_1

### Notes on the sheet
- Note
- The IC Contains protection diode for the LED

### Library data of the parts
D8-D11 = SS14: as D5 on sheet Relay Driver; Mouser Description: Schottky Diodes & Rectifiers SMA 40V 1.0A; RoHS: TRUE; Lead Free: Yes; Manufacturer Part Number: SS14; Device Class L3: Schottky Diodes; Category: Diode; Automotive: No; Digikey Description: DIODE SCHOTTKY 40V 1A SMA; ComponentLink2Description: Datasheet; Device Class L2: Diodes; Height: 2.5mm; Temperature Range High: +125°C; ComponentLink2URL: https://www.onsemi.com/pub/Collateral/SS19-D.PDF; Device Class L1: Discrete Semiconductors; Package: 403AE; Octopart: https://octopart.com/ss14-on+semiconductor-29205033; Max Repetitive Reverse Voltage: 40V; Temperature Range Low: -65°C; Forward Current: 1A; Temperature: -65°C to +125°C
J8 J9 = CON-TB_2X1-196-ST-TH: as J1 on sheet Power Supply; Case/Package: TH-CON; Supplier-1: SP ROAD; Supplier Part Number-1: MKDSN1,5/2
R15 R16 = Res-Array: RES ARRAY 4 RES 1K OHM 1206; Number of Terminals/Pins: 8; Resistance Tolerance: 5%; Temperature Coefficient: 200ppm/°C; Number of Circuits: 4; Resistance: 1kR; Power Per Element: 62.5mW; Voltage Rating: 50V; Circuit Type: Isolated; Case/Package: 0603; RoHS Compliant: Yes; Size Code: 0603; Tolerance: 5%; Min Operating Temperature: -55°C; Height: 0.028inch; Series: YC164; Number of Elements: 4; Length: 0.126inch; Number of Pins: 8; Number of Resistors: 4; Lead Free: Lead Free; Radiation Hardening: No; Max Operating Temperature: 155°C; Case Code (Metric): 3216; Working Voltage: 50V; Case Code (Imperial): 1206; Packaging: Cut Tape; Technology: THICK FILM; Number of Contacts: 8; Width: 0.063inch; Depth: 1.6mm; Terminal Pitch: 0.8mm; Power Dissipation: 62.5mW; Package Quantity: 1; Termination: Convex; Mount: Surface Mount; Military Standard: Not
U7 = TLP292-4: Optoisolator Transistor Output 3750Vrms 4 Channel 16-SO; Manufacturer: Olimex; Manufacturer Part Number: CH340C; Alternate Part Number-1: NA; Case/Package: SOIC16; Supplier-1: LCSC; Supplier Part Number-1: C84681

## Sheet Analog Input.SchDoc
size A; SheetNumber: 7; SheetTotal: 15
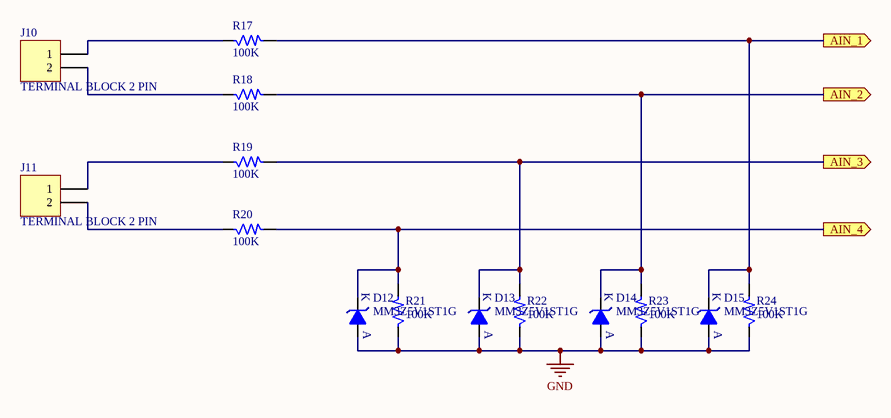
[diagram p6: Analog Input.SchDoc]

### Parts
D12  MM3Z5V1ST1G  [DIO_SOD-323F]
D13  MM3Z5V1ST1G  [DIO_SOD-323F]
D14  MM3Z5V1ST1G  [DIO_SOD-323F]
D15  MM3Z5V1ST1G  [DIO_SOD-323F]
J10  TERMINAL BLOCK 2 PIN  [CON2_P196_1729128_TH_ST]
J11  TERMINAL BLOCK 2 PIN  [CON2_P196_1729128_TH_ST]
R17  100K  [RES_0805]
R18  100K  [RES_0805]
R19  100K  [RES_0805]
R20  100K  [RES_0805]
R21  100K  [RES_0805]
R22  100K  [RES_0805]
R23  100K  [RES_0805]
R24  100K  [RES_0805]

### Ports
AIN_1 (out), AIN_2 (out), AIN_3 (out), AIN_4 (out)

### Nets
GND: D12.A D13.A D14.A D15.A R21.1 R22.1 R23.1 R24.1
NetD12_K: D12.K R20.2 R21.2 ; port AIN_4
NetD13_K: D13.K R19.2 R22.2 ; port AIN_3
NetD14_K: D14.K R18.2 R23.2 ; port AIN_2
NetD15_K: D15.K R17.2 R24.2 ; port AIN_1
NetJ10_1: J10.1 R17.1
NetJ10_2: J10.2 R18.1
NetJ11_1: J11.1 R19.1
NetJ11_2: J11.2 R20.1

### Library data of the parts
D12-D15 = DIO-Z_5.1V-300mW-SOD323: Zener Diode 5.1V 300mW ±2% Surface Mount SOD-323; Manufacturer: Vishay Semiconductors; Alternate Part Number-1: NA; Manufacturer Part Number: MM3Z5V1ST1G; Case/Package: SOD323; Supplier-1: SIRICOM; Supplier Part Number-1: BZT52C5V1S
J10 J11 = CON-TB_2X1-196-ST-TH: as J1 on sheet Power Supply; Case/Package: TH-CON; Supplier-1: SP ROAD; Supplier Part Number-1: MKDSN1,5/2
R17-R24 = RES_100K-0.125W-1%-0805: 100 kOhms ±1% 0.125W, 1/8W Chip Resistor 0805 (2012 Metric) Automotive AEC-Q200 Thick Film; Manufacturer: Walsin; Manufacturer Part Number: WR08X1003FTL; Alternate Part Number-1: NA; Case/Package: 0805; Supplier-1: SIRICOM; Supplier Part Number-1: WR08X1003FTL

## Sheet 4-20mA Sensor.SchDoc
size A; SheetNumber: 8; SheetTotal: 15
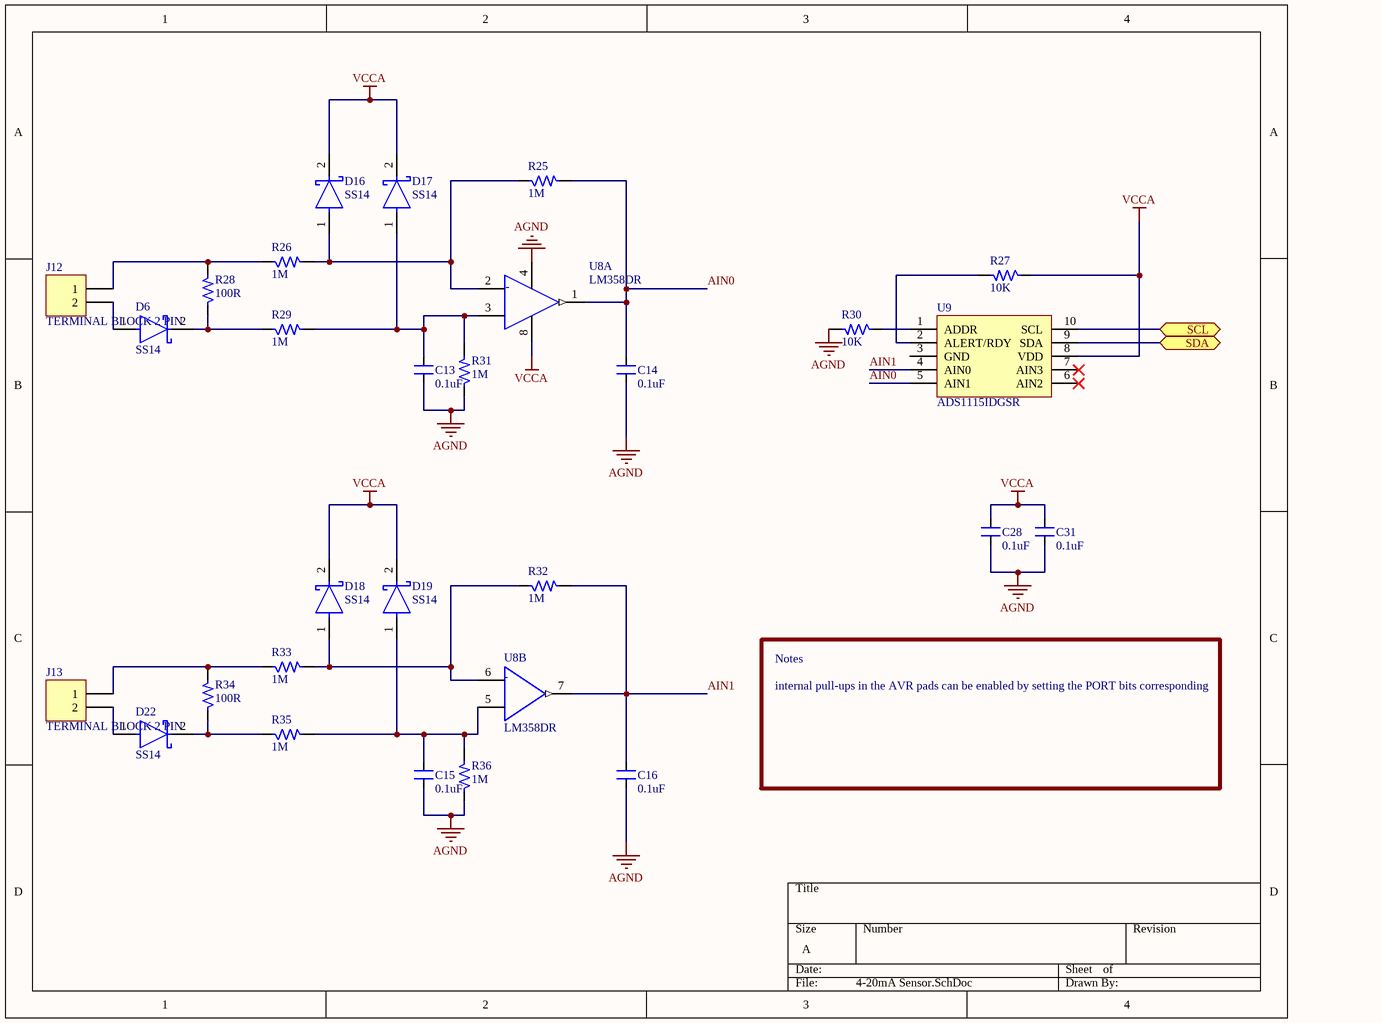
[diagram p7: 4-20mA Sensor.SchDoc]

### Parts
C13  0.1uF  [CAP_0805]
C14  0.1uF  [CAP_0805]
C15  0.1uF  [CAP_0805]
C16  0.1uF  [CAP_0805]
C28  0.1uF  [CAP_0805]
C31  0.1uF  [CAP_0805]
D6  SS14  [FP-403AE-MFG]
D16  SS14  [FP-403AE-MFG]
D17  SS14  [FP-403AE-MFG]
D18  SS14  [FP-403AE-MFG]
D19  SS14  [FP-403AE-MFG]
D22  SS14  [FP-403AE-MFG]
J12  TERMINAL BLOCK 2 PIN  [CON2_P196_1729128_TH_ST]
J13  TERMINAL BLOCK 2 PIN  [CON2_P196_1729128_TH_ST]
R25  1M  [RES_0805]
R26  1M  [RES_0805]
R27  10K  [RES_0805]
R28  100R  [RES_0805]
R29  1M  [RES_0805]
R30  10K  [RES_0805]
R31  1M  [RES_0805]
R32  1M  [RES_0805]
R33  1M  [RES_0805]
R34  100R  [RES_0805]
R35  1M  [RES_0805]
R36  1M  [RES_0805]
U8  LM358DR  [FP-D0008A-IPC_B]  (parts A,B of 2)
U9  ADS1115IDGSR  [VSOP-10_19.6_230_57X12_SMD]

### Ports
SCL (bidir, see Block Diagram[5D], ATMEGA2560-16AU[1C], RTC[1B]), SDA (bidir, see Block Diagram[5D], ATMEGA2560-16AU[1C], RTC[1B])

### Nets
AGND: C13.1 C14.1 C15.1 C16.1 C28.1 C31.1 R30.2 R31.1 R36.1 U8.4(V-)
VCCA: C28.2 C31.2 D16.2(C) D17.2(C) D18.2(C) D19.2(C) R27.1 U8.8(V+) U9.8(VDD)
AIN0: C14.2 R25.2 U8.1(1OUT) U9.5(AIN1)
AIN1: C16.2 R32.2 U8.7(2OUT) U9.4(AIN0)
NetC13_2: C13.2 D17.1(A) R29.2 R31.2 U8.3(IN1+)
NetC15_2: C15.2 D19.1(A) R35.2 R36.2 U8.5(IN2+)
NetD6_1: D6.1(A) J12.2
NetD6_2: D6.2(C) R28.1 R29.1
NetD16_1: D16.1(A) R25.1 R26.2 U8.2(IN1-)
NetD18_1: D18.1(A) R32.1 R33.2 U8.6(IN2-)
NetD22_1: D22.1(A) J13.2
NetD22_2: D22.2(C) R34.1 R35.1
NetJ12_1: J12.1 R26.1 R28.2
NetJ13_1: J13.1 R33.1 R34.2
NetR7_1: U9.10(SCL) ; port SCL
NetR8_1: U9.9(SDA) ; port SDA
NetR27_2: R27.2 U9.2(ALERT/RDY)
NetR30_1: R30.1 U9.1(ADDR)

Not connected (* = marked no-connect by the designer): U9 3(GND) 6(AIN2)* 7(AIN3)*

### Notes on the sheet
- Notes
- internal pull-ups in the AVR pads can be enabled by setting the PORT bits corresponding
- (in symbol LM358, part A) -
- (in symbol LM358, part B) -

### Library data of the parts
C13-C16 C28 C31 = CAP_0.1uF-50V-5%-0805: as C9 on sheet ATMEGA2560-16AU; Case/Package: 0805; Supplier-1: SIRICOM; Supplier Part Number-1: 0805B104J500CT
D6 D16-D19 D22 = SS14: as D5 on sheet Relay Driver; Mouser Description: Schottky Diodes & Rectifiers SMA 40V 1.0A; RoHS: TRUE; Lead Free: Yes; Manufacturer Part Number: SS14; Device Class L3: Schottky Diodes; Category: Diode; Automotive: No; Digikey Description: DIODE SCHOTTKY 40V 1A SMA; ComponentLink2Description: Datasheet; Device Class L2: Diodes; Height: 2.5mm; Temperature Range High: +125°C; ComponentLink2URL: https://www.onsemi.com/pub/Collateral/SS19-D.PDF; Device Class L1: Discrete Semiconductors; Package: 403AE; Octopart: https://octopart.com/ss14-on+semiconductor-29205033; Max Repetitive Reverse Voltage: 40V; Temperature Range Low: -65°C; Forward Current: 1A; Temperature: -65°C to +125°C
J12 J13 = CON-TB_2X1-196-ST-TH: as J1 on sheet Power Supply; Case/Package: TH-CON; Supplier-1: SP ROAD; Supplier Part Number-1: MKDSN1,5/2
R25 R26 R29 R31-R33 R35 R36 = RES_1M-0.125W-1%-0805: as R6 on sheet ATMEGA2560-16AU; Case/Package: 0805; Supplier-1: SIRICOM; Supplier Part Number-1: WR08X1004FTL
R27 R30 = RES_10K-0.125W-1%-0805: 10 kOhms ±1% 0.125W, 1/8W Chip Resistor 0805 (2012 Metric) Automotive AEC-Q200 Thick Film; Manufacturer: CTS; Manufacturer Part Number: WR08X1002FTL; Case/Package: 0805; Supplier-1: SIRICOM; Supplier Part Number-1: WR08X1002FTL; Alternate Part Number-1: WR08X1002FTL
R28 R34 = RES_100R-0.125W-1%-0805: 100 Ohms ±1% 0.125W, 1/8W Chip Resistor 0805 (2012 Metric) Automotive AEC-Q200, Pulse Withstanding Thick Film; Manufacturer: Walsin; Manufacturer Part Number: WR08X1000FTL; Case/Package: 0805; Supplier-1: SIRICOM; Supplier Part Number-1: WR08X1000FTL; Alternate Part Number-1: WR08X1000FTL
U8 = LM358: IC OPAMP GP 2 CIRCUIT 8SOIC; Output Current: 30mA; Min Dual Supply Voltage: 1.5V; Input Offset Voltage (Vos): 7mV; Power Supply Rejection Ratio (PSRR): 65dB; Unity Gain Bandwidth Product: 700kHz; Number of Channels: 2; Min Supply Voltage: 3V; Max Dual Supply Voltage: 16V; Dual Supply Voltage: 9V; Max Supply Voltage: 32V; Nominal Supply Current: 1.2mA; Slew Rate: 0.3V/µs; Input Bias Current: 250nA; Voltage Gain: 100dB; Operating Supply Current: 1mA; REACH SVHC: No SVHC; Package Quantity: 2500; Width: 3.91mm; Max Operating Temperature: 70°C; Min Operating Temperature: 0°C; Mount: Surface Mount; Length: 4.9mm; Radiation Hardening: No; Case/Package: SOIC; Lead Free: Lead Free; Number of Elements: 2; Packaging: Tape and Reel; Output Current per Channel: 30mA; Number of Circuits: 2; Bandwidth: 700kHz; Operating Supply Voltage: 16V; Gain Bandwidth Product: 700kHz; Number of Pins: 8; Number of Amplifiers: 2; Height: 1.58mm; Common Mode Rejection Ratio: 65dB; Contact Plating: Gold
U9 = IC_ADS1115IDGSR: Analog to Digital Converters - ADC 16B ADC w/ Int MUX PGA Comp Osc & Ref; Manufacturer: Texas Instruments; Alternate Part Number-1: NA; Manufacturer Part Number: ADS1115IDGSR; Case/Package: MSOP-10; Supplier-1: Mouser; Supplier Part Number-1: 595-ADS1115IDGSR

## Sheet RTC.SchDoc
size A; SheetNumber: 9; SheetTotal: 15
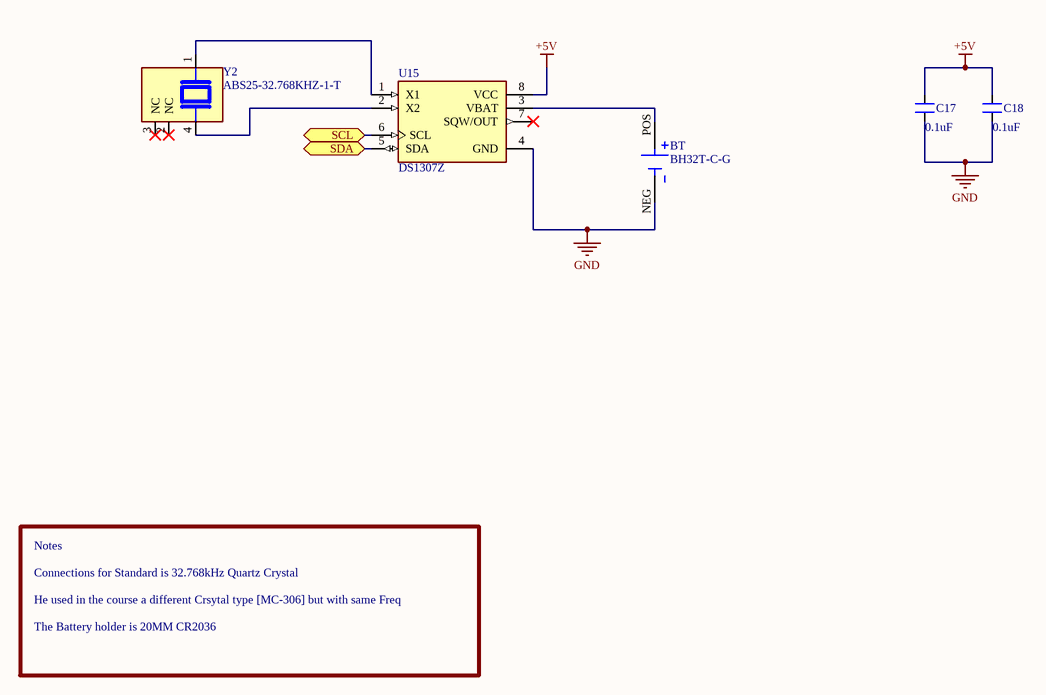
[diagram p8: RTC.SchDoc]

### Parts
BT  BH32T-C-G  [BAT_BH32T-C-G]
C17  0.1uF  [CAP_0805]
C18  0.1uF  [CAP_0805]
U15  DS1307Z  [SOIC127P600X175-8N]
Y2  ABS25-32.768KHZ-1-T  [XTAL_ABS25-32.768KHZ-1-T]

### Ports
SCL (bidir, see Block Diagram[5D], 4-20mA Sensor[4B], ATMEGA2560-16AU[1C]), SDA (bidir, see Block Diagram[5D], 4-20mA Sensor[4B], ATMEGA2560-16AU[1C])

### Nets
+5V: C17.2 C18.2 U15.8(VCC)
GND: BT.NEG C17.1 C18.1 U15.4(GND)
NetBT_POS: BT.POS U15.3(VBAT)
NetR7_1: U15.6(SCL) ; port SCL
NetR8_1: U15.5(SDA) ; port SDA
NetU15_1: U15.1(X1) Y2.1
NetU15_2: U15.2(X2) Y2.4

Not connected (* = marked no-connect by the designer): U15 7(SQW/OUT)*; Y2 2(NC)* 3(NC)*

### Notes on the sheet
- Notes
- Connections for Standard is 32.768kHz Quartz Crystal
- He used in the course a different Crsytal type [MC-306] but with same Freq
- The Battery holder is 20MM CR2036

### Library data of the parts
BT = BH32T-C-G: BATTERY HOLDER COIN 20MM PC PIN; MF: MPD; Value: *; Availability: Unavailable; SnapEDA_Link: https://www.snapeda.com/parts/BH32T-C-G/Memory%20Protection%20Devices/view-part/4219673/?ref=snap; Package: None; MP: BH32T-C-G; Price: None
C17 C18 = CAP_0.1uF-50V-5%-0805: as C9 on sheet ATMEGA2560-16AU; Case/Package: 0805; Supplier-1: SIRICOM; Supplier Part Number-1: 0805B104J500CT
U15 = DS1307Z: Real Time Clock _RTC_ IC Clock/Calendar 56B IÂ²C, 2-Wire Serial 8-SOIC _0.154, 3.90mm Width_; MF: Maxim Integrated; Availability: Unavailable; Price: None; Package: SO-8 Maxim Integrated; Value: *; SnapEDA_Link: https://www.snapeda.com/parts/DS1307Z/Maxim%20Integrated/view-part/524266/?ref=snap; MP: DS1307Z
Y2 = ABS25-32.768KHZ-1-T: 32.768 kHz Â±10ppm Crystal 12.5pF 50 kOhms 4-SOJ, 5.50mm pitch; MF: Abracon LLC; Price: None; Purchase-URL: https://pricing.snapeda.com/search/part/ABS25-32.768KHZ-1-T/?ref=eda; Package: 4-4 Abracon; Check_prices: https://www.snapeda.com/parts/ABS25-32.768KHZ-1-T/Abracon+LLC/view-part/?ref=eda; Value: *; MP: ABS25-32.768KHZ-1-T; Availability: In Stock; SnapEDA_Link: https://www.snapeda.com/parts/ABS25-32.768KHZ-1-T/Abracon+LLC/view-part/?ref=snap

## Sheet BLE.SchDoc
size A; SheetNumber: 13; SheetTotal: 15
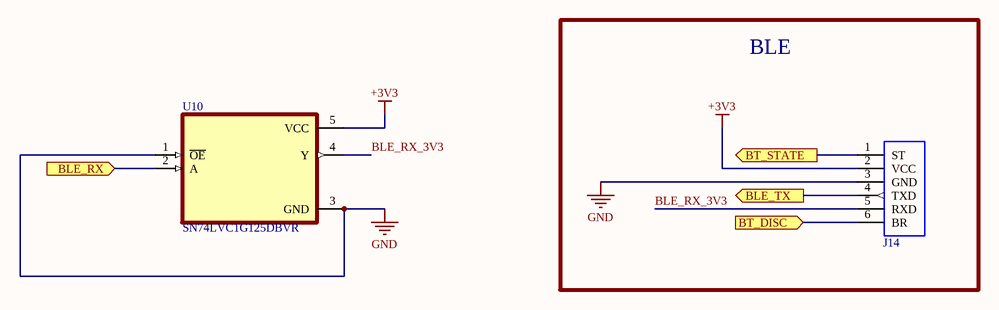
[diagram p9: BLE.SchDoc]

### Parts
J14  61300611821  [HM-10_BLE_MODULE]  (value not drawn)
U10  SN74LVC1G125DBVR  [SOT95P280X145-5N]

### Blocks framed on the sheet
BLE: J14

### Ports
BLE_RX (in, see Block Diagram[4B]), BLE_TX (out, see Block Diagram[4B]), BT_DISC (in, see Block Diagram[4B], ATMEGA2560-16AU[1C]), BT_STATE (out, see Block Diagram[4B], ATMEGA2560-16AU[1C])

### Nets
+3V3: J14.2(VCC) U10.5(VCC)
GND: J14.3(GND) U10.1(~{OE}) U10.3(GND)
BLE_RX_3V3: J14.5(RXD) U10.4(Y)
NetJ14_1: J14.1(ST) ; port BT_STATE
NetJ14_4: J14.4(TXD) ; port BLE_TX
NetJ14_6: J14.6(BR) ; port BT_DISC
NetU3_13: U10.2(A) ; port BLE_RX

### Library data of the parts
J14 = HM-10_BLE_MODULE: WR-PHD Socket Header, THT, Vertical, pitch 2.54mm, 1 Row, 6P; Manufacturer: Wurth Elektronik; Contact Resistance: 20mΩ; Rated Current: 3A; Working Voltage: 250V; Withstanding Voltage: 500V; ComponentLink1Description: Website Link; ComponentLink1URL: https://www.we-online.com/redexpert/article/61300611821?ad; ComponentLink2Description: Datasheet Link; ComponentLink2URL: https://www.we-online.com/redexpert/spec/61300611821?ad; Manufacturer Part Number: 61300611821; Category: Board-to-Board Connectors; Match Code: WR-PHD; Mount: Through Hole; Operating Temperature Max: 125°C; Operating Temperature Min: -40°C; Packaging: Tray; Gender: Socket Header; Number of Pins: 6; Number of Rows: 1; Orientation: Vertical; Pitch: 2.54mm
U10 = SN74LVC1G125DBVR: Single Bus Buffer Gate With 3-State Outputs 5-SOT-23 -40 to 125; MF: Texas Instruments; Purchase-URL: https://pricing.snapeda.com/search/part/SN74LVC1G125DBVR/?ref=eda; Package: SOT-23-5 Texas Instruments; MP: SN74LVC1G125DBVR; Price: None; Availability: Good; Value: *; Check_prices: https://www.snapeda.com/parts/SN74LVC1G125DBVR/Texas%20Instruments/view-part/249684/?ref=eda; SnapEDA_Link: https://www.snapeda.com/parts/SN74LVC1G125DBVR/Texas%20Instruments/view-part/249684/?ref=snap

## Sheet WIFI.SchDoc
size A; SheetNumber: 11; SheetTotal: 15
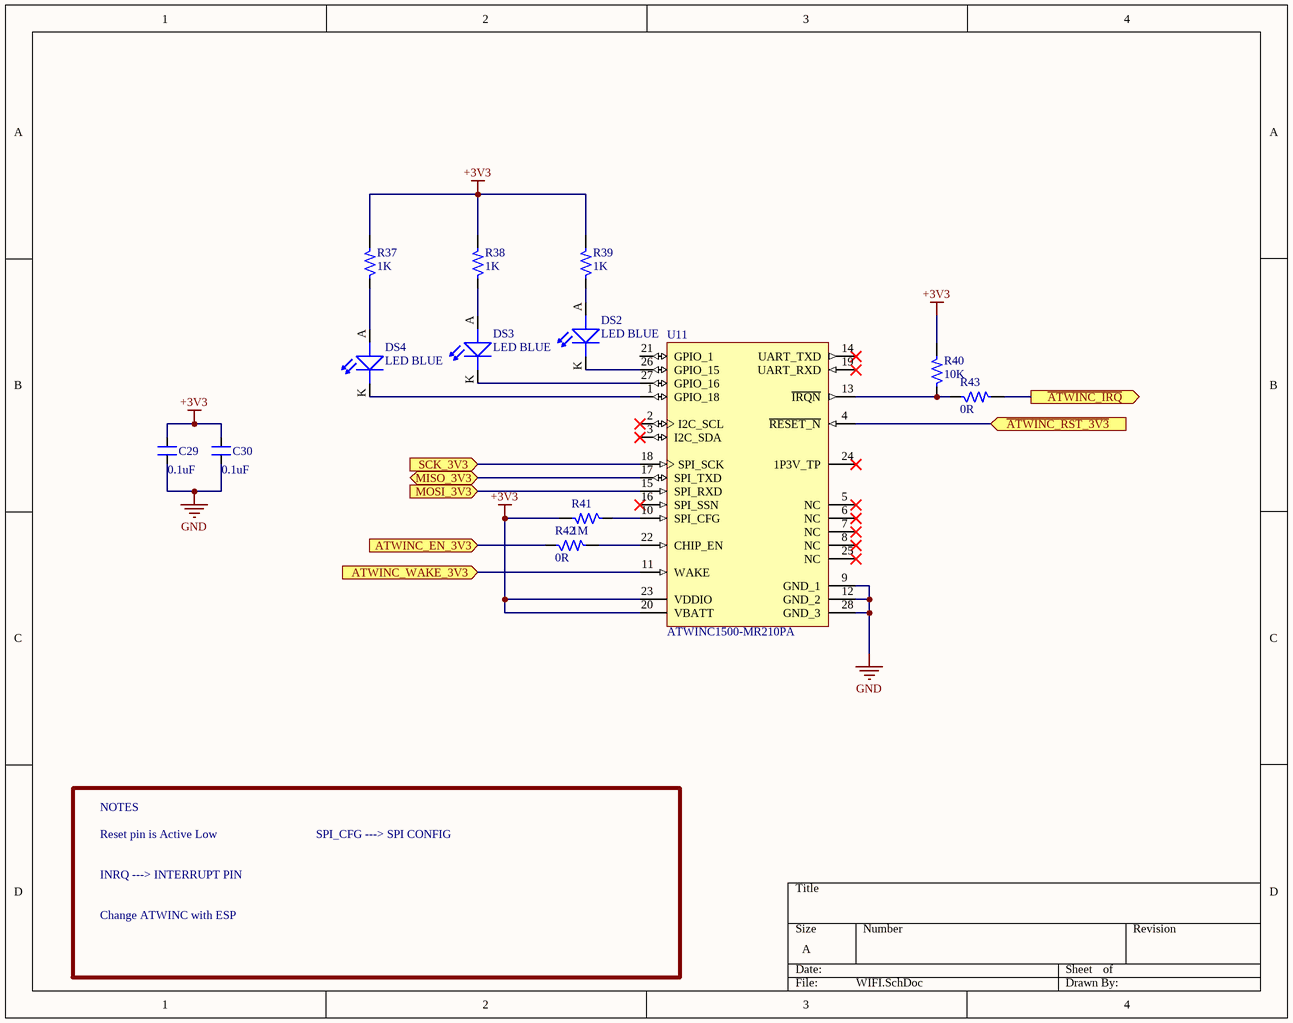
[diagram p10: WIFI.SchDoc]

### Parts
C29  0.1uF  [CAP_0805]
C30  0.1uF  [CAP_0805]
DS2  LED BLUE  [LED_0805]
DS3  LED BLUE  [LED_0805]
DS4  LED BLUE  [LED_0805]
R37  1K  [RES_0805]
R38  1K  [RES_0805]
R39  1K  [RES_0805]
R40  10K  [RES_0805]
R41  1M  [RES_0805]
R42  0R  [RES_0805]
R43  0R  [RES_0805]
U11  ATWINC1500-MR210PA  [ATML-ATWINC1500-MR210PA-28_V]

### Ports
ATWINC_EN_3V3 (in, see Block Diagram[2D], SPI Bus Transceiver[3C]), ATWINC_WAKE_3V3 (in, see Block Diagram[2C], SPI Bus Transceiver[3C]), MISO_3V3 (bidir, see Block Diagram[1C], SD Card[2B], SPI Bus Transceiver[3B]), MOSI_3V3 (in, see Block Diagram[1C], SD Card[3B], SPI Bus Transceiver[3C]), SCK_3V3 (in, see Block Diagram[1C], SD Card[2B], SPI Bus Transceiver[3C]), ~{ATWINC_IRQ} (out, see Block Diagram[2D]), ~{ATWINC_RST_3V3} (in, see Block Diagram[2D], SPI Bus Transceiver[3C])

### Nets
+3V3: C29.2 C30.2 R37.2 R38.2 R39.2 R40.2 R41.2 U11.20(VBATT) U11.23(VDDIO)
GND: C29.1 C30.1 U11.9(GND_1) U11.12(GND_2) U11.28(GND_3)
NetDS2_A: DS2.A(ANODE) R39.1
NetDS2_K: DS2.K(CATHODE) U11.26(GPIO_15)
NetDS3_A: DS3.A(ANODE) R38.1
NetDS3_K: DS3.K(CATHODE) U11.27(GPIO_16)
NetDS4_A: DS4.A(ANODE) R37.1
NetDS4_K: DS4.K(CATHODE) U11.1(GPIO_18)
NetJ15_3: U11.15(SPI_RXD) ; port MOSI_3V3
NetJ15_5: U11.18(SPI_SCK) ; port SCK_3V3
NetJ15_7: U11.17(SPI_TXD) ; port MISO_3V3
NetR40_1: R40.1 R43.1 U11.13(~{IRQN})
NetR41_1: R41.1 U11.10(SPI_CFG)
NetR42_1: R42.1 ; port ATWINC_EN_3V3
NetR42_2: R42.2 U11.22(CHIP_EN)
NetR43_2: R43.2 ; port ~{ATWINC_IRQ}
NetU11_4: U11.4(~{RESET_N}) ; port ~{ATWINC_RST_3V3}
NetU11_11: U11.11(WAKE) ; port ATWINC_WAKE_3V3

Not connected (* = marked no-connect by the designer): U11 2(I2C_SCL)* 3(I2C_SDA)* 5(NC)* 6(NC)* 7(NC)* 8(NC)* 14(UART_TXD)* 16(SPI_SSN)* 19(UART_RXD)* 21(GPIO_1) 24(1P3V_TP)* 25(NC)*

### Notes on the sheet
- NOTES
- Reset pin is Active Low
- SPI_CFG ---> SPI CONFIG
- INRQ ---> INTERRUPT PIN
- Change ATWINC with ESP

### Library data of the parts
C29 C30 = CAP_0.1uF-50V-5%-0805: as C9 on sheet ATMEGA2560-16AU; Case/Package: 0805; Supplier-1: SIRICOM; Supplier Part Number-1: 0805B104J500CT
DS2-DS4 = LED_BLUE-3V3-20mA-0805: as DS1 on sheet Power Supply; Case/Package: 0805; Supplier-1: SP ROAD; Supplier Part Number-1: LTST-C171TBKT
R37-R39 = RES_1K-0.125W-1%-0805: as R1 on sheet Power Supply; Case/Package: 0805; Supplier-1: SP ROAD; Supplier Part Number-1: RC0805JR-071KL; Alternate Part Number-1: WR08X1001FTL
R40 = RES_10K-0.125W-1%-0805: as R27 on sheet 4-20mA Sensor; Case/Package: 0805; Supplier-1: SIRICOM; Supplier Part Number-1: WR08X1002FTL; Alternate Part Number-1: WR08X1002FTL
R41 = RES_1M-0.125W-1%-0805: as R6 on sheet ATMEGA2560-16AU; Case/Package: 0805; Supplier-1: SIRICOM; Supplier Part Number-1: WR08X1004FTL
R42 R43 = RES_0R-0.125W-1%-0805: 0 Ohms Jumper 0.125W, 1/8W Chip Resistor 0805 (2012 Metric) Automotive AEC-Q200 Thick Film; Manufacturer: Walsin; Manufacturer Part Number: WR08X000PTL; Case/Package: 0805; Supplier-1: SIRICOM; Supplier Part Number-1: WR08X000PTL; Alternate Part Number-1: WR08X000PTL
U11 = ATWINC1500-MR210PA: IEEE 802.11 b/g/n IoT Module, 2.4 GHz, 2.7 to 3.6 V, -40 to 85 degC, 28-Pin Module, RoHS, Tray; VDDIO Min: 2.7 V; Frequency: 2400000000 Hz; VDDIO Max: 3.6 V; Number of Channels: 1; ComponentLink3Description: Package Specification; DatasheetVersion: Rev. 42376C; ComponentLink1URL: http://www.atmel.com/; PackageDescription: 28-Pin Module, Body 21.72 x 14.73 mm, Pitch 1.016 mm; ComponentLink2URL: http://www.atmel.com/images/atmel-42376-smartconnect-winc1500-mr210pa_datasheet.pdf; Temperature Min: -40 degC; Packing: Tray; PartNumber: ATWINC1500-MR210PA; PackageVersion: Rev. 42376C, 03/2015; ComponentLink2Description: Datasheet; ComponentLink1Description: Manufacturer URL; RoHS: TRUE; Temperature Max: 85 degC; Generic Part Number: ATWINC1500; Mounting Technology: Surface Mount; ComponentLink3URL: http://www.atmel.com/images/atmel-42376-smartconnect-winc1500-mr210pa_datasheet.pdf

## Sheet SD Card.SchDoc
size A; SheetNumber: 10; SheetTotal: 15
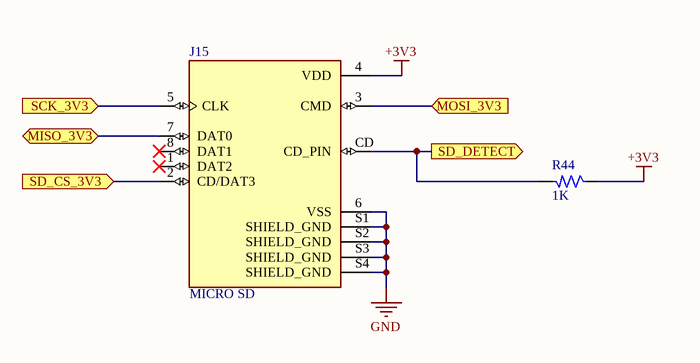
[diagram p11: SD Card.SchDoc]

### Parts
J15  MICRO SD  [AMPHENOL_GTFP08131Y2HR]
R44  1K  [RES_0805]

### Ports
MISO_3V3 (bidir, see Block Diagram[1C], SPI Bus Transceiver[3B], WIFI[2B]), MOSI_3V3 (in, see Block Diagram[1C], SPI Bus Transceiver[3C], WIFI[2B]), SCK_3V3 (in, see Block Diagram[1C], SPI Bus Transceiver[3C], WIFI[2B]), SD_CS_3V3 (in, see Block Diagram[2C], SPI Bus Transceiver[3C]), SD_DETECT (out, see Block Diagram[2C], ATMEGA2560-16AU[1C])

### Nets
+3V3: J15.4(VDD) R44.1
GND: J15.6(VSS) J15.S1(SHIELD_GND) J15.S2(SHIELD_GND) J15.S3(SHIELD_GND) J15.S4(SHIELD_GND)
NetJ15_2: J15.2(CD/DAT3) ; port SD_CS_3V3
NetJ15_3: J15.3(CMD) ; port MOSI_3V3
NetJ15_5: J15.5(CLK) ; port SCK_3V3
NetJ15_7: J15.7(DAT0) ; port MISO_3V3
NetJ15_CD: J15.CD(CD_PIN) R44.2 ; port SD_DETECT

Not connected (* = marked no-connect by the designer): J15 1(DAT2)* 8(DAT1)*

### Library data of the parts
J15 = MICRO SD: GTFP08131Y2HR; Availability: Unavailable; Price: None; MP: GTFP08131Y2HR; Package: None; Value: *
R44 = RES_1K-0.125W-1%-0805: as R1 on sheet Power Supply; Case/Package: 0805; Supplier-1: SP ROAD; Supplier Part Number-1: RC0805JR-071KL; Alternate Part Number-1: WR08X1001FTL